# Altium project LXe_digitizer.PrjPcb (part 2 of 3)

## Sheet Processing Unit.SchDoc
size A1; DocumentNumber: 3; SheetNumber: 3; SheetTotal: 7
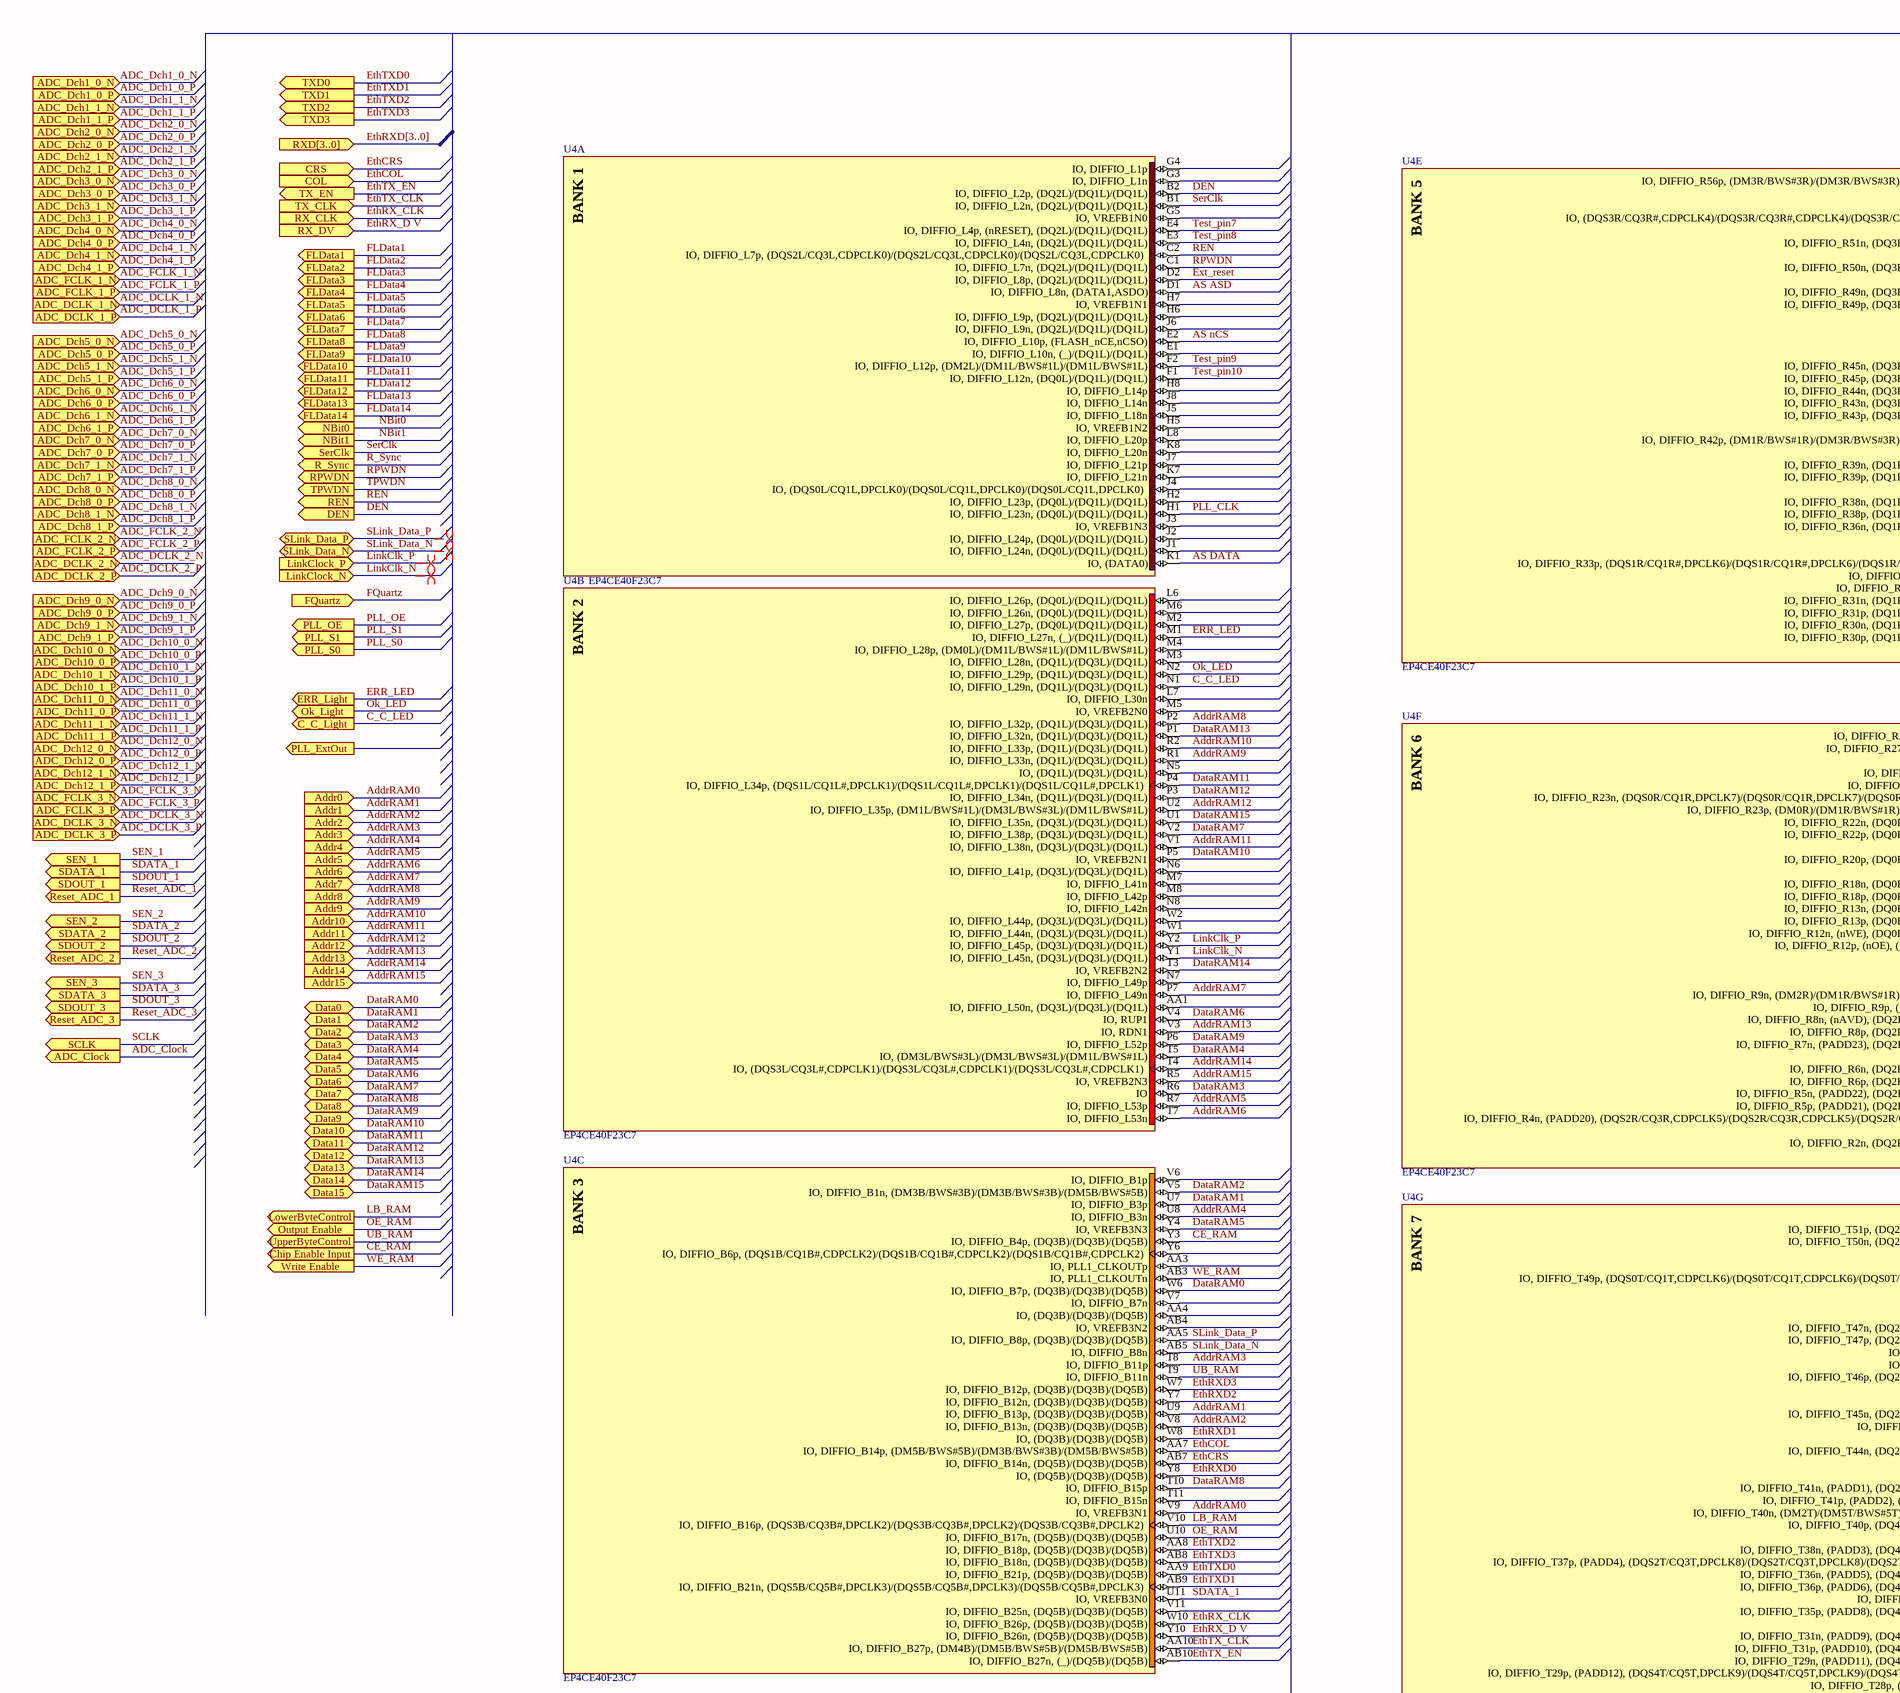
[diagram p4: Processing Unit.SchDoc, top left]
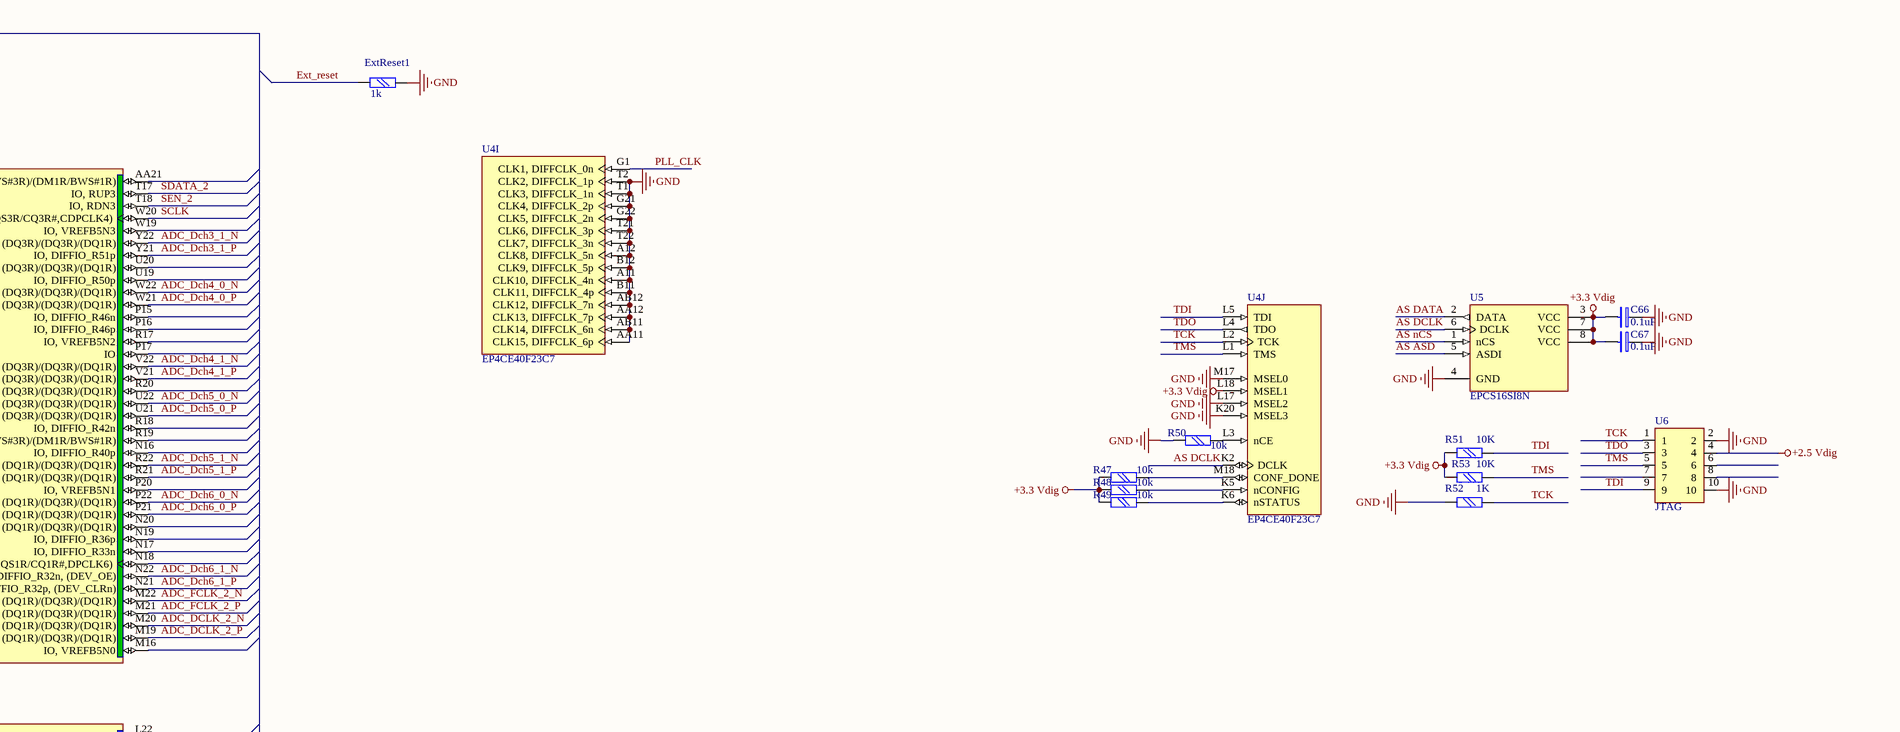
[diagram p5: Processing Unit.SchDoc, top right]
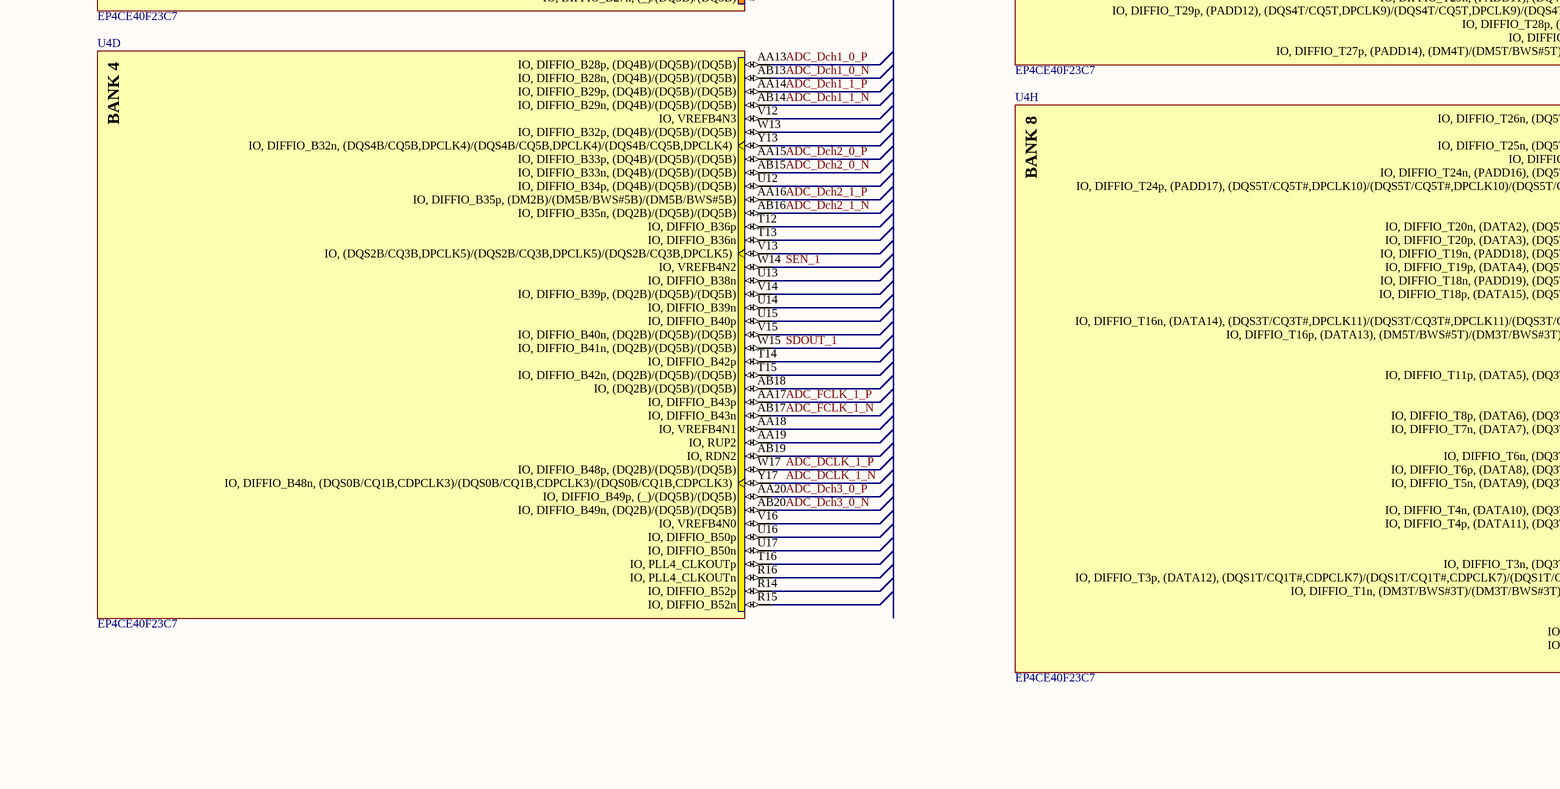
[diagram p6: Processing Unit.SchDoc, bottom left]
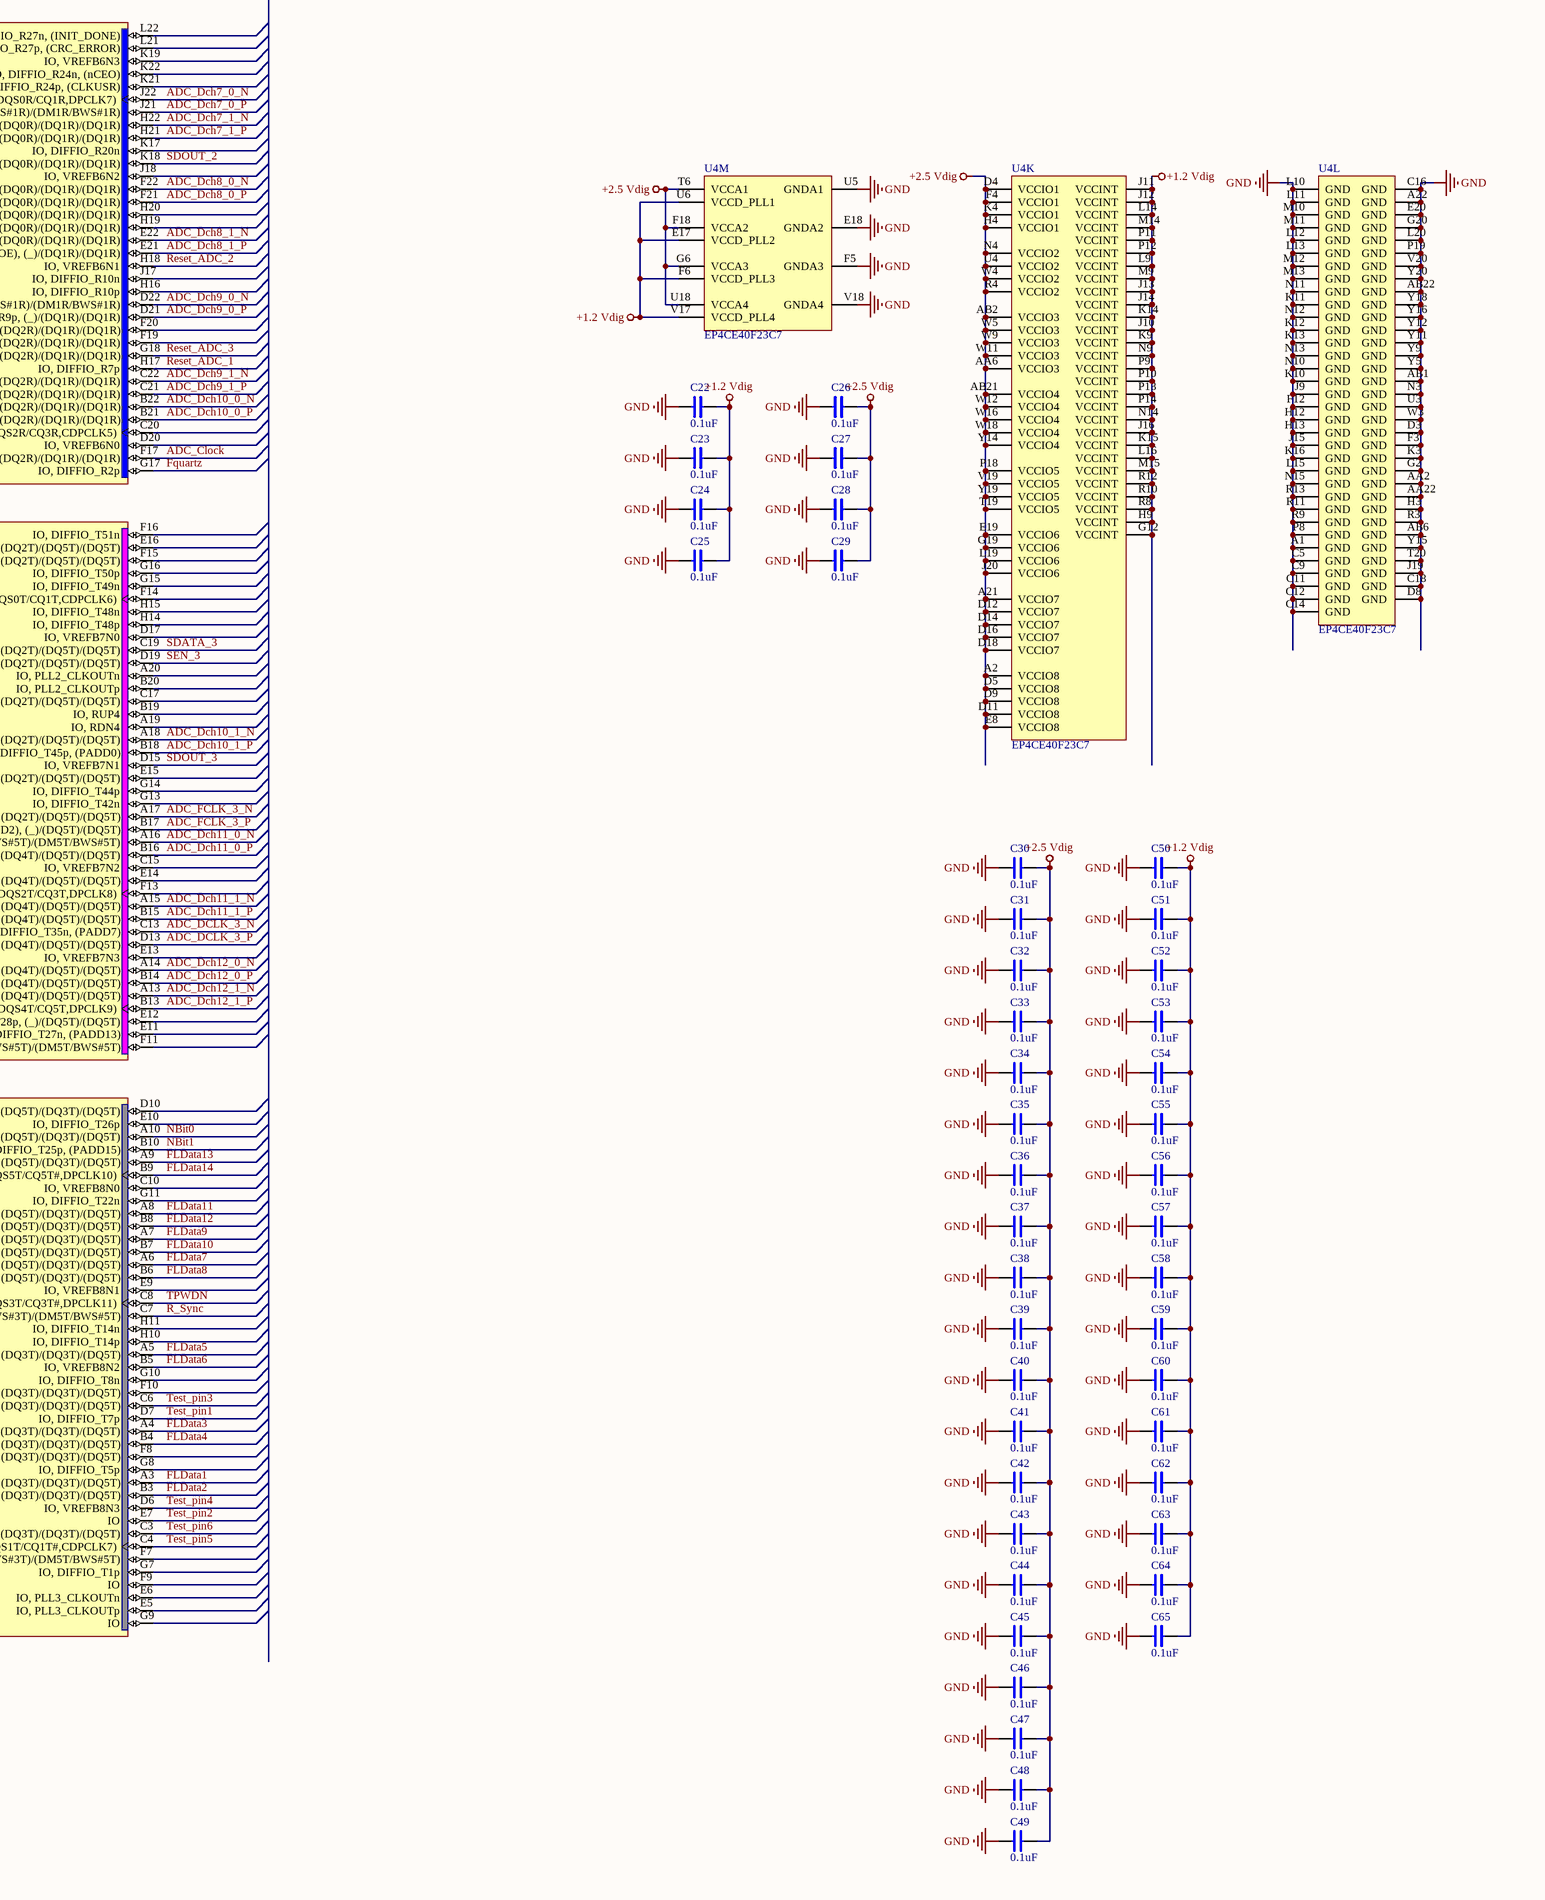
[diagram p7: Processing Unit.SchDoc, bottom right]

### Parts
C22  0.1uF  [0402]
C23  0.1uF  [0402]
C24  0.1uF  [0402]
C25  0.1uF  [0402]
C26  0.1uF  [0402]
C27  0.1uF  [0402]
C28  0.1uF  [0402]
C29  0.1uF  [0402]
C30  0.1uF  [0402]
C31  0.1uF  [0402]
C32  0.1uF  [0402]
C33  0.1uF  [0402]
C34  0.1uF  [0402]
C35  0.1uF  [0402]
C36  0.1uF  [0402]
C37  0.1uF  [0402]
C38  0.1uF  [0402]
C39  0.1uF  [0402]
C40  0.1uF  [0402]
C41  0.1uF  [0402]
C42  0.1uF  [0402]
C43  0.1uF  [0402]
C44  0.1uF  [0402]
C45  0.1uF  [0402]
C46  0.1uF  [0402]
C47  0.1uF  [0402]
C48  0.1uF  [0402]
C49  0.1uF  [0402]
C50  0.1uF  [0402]
C51  0.1uF  [0402]
C52  0.1uF  [0402]
C53  0.1uF  [0402]
C54  0.1uF  [0402]
C55  0.1uF  [0402]
C56  0.1uF  [0402]
C57  0.1uF  [0402]
C58  0.1uF  [0402]
C59  0.1uF  [0402]
C60  0.1uF  [0402]
C61  0.1uF  [0402]
C62  0.1uF  [0402]
C63  0.1uF  [0402]
C64  0.1uF  [0402]
C65  0.1uF  [0402]
C66  0.1uF  [chip0603]
C67  0.1uF  [chip0603]
ExtReset1  1k  [chip0603]
R47  10k  [chip0603]
R48  10k  [chip0603]
R49  10k  [chip0603]
R50  10k  [chip0603]
R51  10K  [chip0603]
R52  1K  [chip0603]
R53  10K  [chip0603]
U4  EP4CE40F23C7  [FBGA484]  (parts A,B,C,D,E,F,G,H,I,J,K,L,M of 13)
U5  EPCS16SI8N  [8SO200]
U6  JTAG  [IDC10]

### Ports
ADC_Clock (out), ADC_Dch1_0_N (in), ADC_Dch1_0_P (in), ADC_Dch1_1_N (in), ADC_Dch1_1_P (in), ADC_Dch2_0_N (in), ADC_Dch2_0_P (in), ADC_Dch2_1_N (in), ADC_Dch2_1_P (in), ADC_Dch3_0_N (in), ADC_Dch3_0_P (in), ADC_Dch3_1_N (in), ADC_Dch3_1_P (in), ADC_Dch4_0_N (in), ADC_Dch4_0_P (in), ADC_Dch4_1_N (in), ADC_Dch4_1_P (in), ADC_Dch5_0_N (in), ADC_Dch5_0_P (in), ADC_Dch5_1_N (in), ADC_Dch5_1_P (in), ADC_Dch6_0_N (in), ADC_Dch6_0_P (in), ADC_Dch6_1_N (in), ADC_Dch6_1_P (in), ADC_Dch7_0_N (in), ADC_Dch7_0_P (in), ADC_Dch7_1_N (in), ADC_Dch7_1_P (in), ADC_Dch8_0_N (in), ADC_Dch8_0_P (in), ADC_Dch8_1_N (in), ADC_Dch8_1_P (in), ADC_Dch9_0_N (in), ADC_Dch9_0_P (in), ADC_Dch9_1_N (in), ADC_Dch9_1_P (in), ADC_Dch10_0_N (in), ADC_Dch10_0_P (in), ADC_Dch10_1_N (in), ADC_Dch10_1_P (in), ADC_Dch11_0_N (in), ADC_Dch11_0_P (in), ADC_Dch11_1_N (in), ADC_Dch11_1_P (in), ADC_Dch12_0_N (in), ADC_Dch12_0_P (in), ADC_Dch12_1_N (in), ADC_Dch12_1_P (in), ADC_DCLK_1_N (in), ADC_DCLK_1_P (in), ADC_DCLK_2_N (in), ADC_DCLK_2_P (in), ADC_DCLK_3_N (in), ADC_DCLK_3_P (in), ADC_FCLK_1_N (in), ADC_FCLK_1_P (in), ADC_FCLK_2_N (in), ADC_FCLK_2_P (in), ADC_FCLK_3_N (in), ADC_FCLK_3_P (in), Addr0 (in), Addr1 (in), Addr2 (in), Addr3 (in), Addr4 (in), Addr5 (in), Addr6 (in), Addr7 (in), Addr8 (in), Addr9 (in), Addr10 (in), Addr11 (in), Addr12 (in), Addr13 (in), Addr14 (in), Addr15 (in), C_C_Light (out), Chip Enable Input (out), COL (in), CRS (in), Data0 (bidir), Data1 (bidir), Data2 (bidir), Data3 (bidir), Data4 (bidir), Data5 (bidir), Data6 (bidir), Data7 (bidir), Data8 (bidir), Data9 (bidir), Data10 (bidir), Data11 (bidir), Data12 (bidir), Data13 (bidir), Data14 (bidir), Data15 (bidir), DEN (out), ERR_Light (out), FLData1 (out), FLData2 (out), FLData3 (out), FLData4 (out), FLData5 (out), FLData6 (out), FLData7 (out), FLData8 (out), FLData9 (out), FLData10 (out), FLData11 (out), FLData12 (out), FLData13 (out), FLData14 (out), FQuartz (in), LinkClock_N (in), LinkClock_P (in), LowerByteControl (out), NBit0 (out), NBit1 (out), Ok_Light (out), Output Enable (out), PLL_ExtOut (out), PLL_OE (out), PLL_S0 (out), PLL_S1 (out), R_Sync (out), REN (out), Reset_ADC_1 (out), Reset_ADC_2 (out), Reset_ADC_3 (out), RPWDN (out), RX_CLK (in), RX_DV (in), RXD[3..0] (in), SCLK (out), SDATA_1 (out), SDATA_2 (out), SDATA_3 (out), SDOUT_1 (out), SDOUT_2 (out), SDOUT_3 (out), SEN_1 (out), SEN_2 (out), SEN_3 (out), SerClk (out), SLink_Data_N (bidir), SLink_Data_P (bidir), TPWDN (out), TX_CLK (in), TX_EN (out), TXD0 (out), TXD1 (out), TXD2 (out), TXD3 (out), UpperByteControl (out), Write Enable (out)

### Nets
+1.2 Vdig: C22.2 C23.2 C24.2 C25.2 C50.2 C51.2 C52.2 C53.2 C54.2 C55.2 C56.2 C57.2 C58.2 C59.2 C60.2 C61.2 C62.2 C63.2 C64.2 C65.2 U4.E17(VCCD_PLL2) U4.F6(VCCD_PLL3) U4.G12(VCCINT) U4.H9(VCCINT) U4.J10(VCCINT) U4.J11(VCCINT) U4.J12(VCCINT) U4.J13(VCCINT) U4.J14(VCCINT) U4.J16(VCCINT) U4.K9(VCCINT) U4.K14(VCCINT) U4.K15(VCCINT) U4.L9(VCCINT) U4.L14(VCCINT) U4.L16(VCCINT) U4.M9(VCCINT) U4.M14(VCCINT) U4.M15(VCCINT) U4.N9(VCCINT) U4.N14(VCCINT) U4.P9(VCCINT) U4.P10(VCCINT) U4.P11(VCCINT) U4.P12(VCCINT) U4.P13(VCCINT) U4.P14(VCCINT) U4.R8(VCCINT) U4.R10(VCCINT) U4.R12(VCCINT) U4.U6(VCCD_PLL1) U4.V17(VCCD_PLL4)
+2.5 Vdig: C26.2 C27.2 C28.2 C29.2 C30.2 C31.2 C32.2 C33.2 C34.2 C35.2 C36.2 C37.2 C38.2 C39.2 C40.2 C41.2 C42.2 C43.2 C44.2 C45.2 C46.2 C47.2 C48.2 C49.2 U4.A2(VCCIO8) U4.A21(VCCIO7) U4.AA6(VCCIO3) U4.AB2(VCCIO3) U4.AB21(VCCIO4) U4.D4(VCCIO1) U4.D5(VCCIO8) U4.D9(VCCIO8) U4.D11(VCCIO8) U4.D12(VCCIO7) U4.D14(VCCIO7) U4.D16(VCCIO7) U4.D18(VCCIO7) U4.E8(VCCIO8) U4.E19(VCCIO6) U4.F4(VCCIO1) U4.F18(VCCA2) U4.G6(VCCA3) U4.G19(VCCIO6) U4.H4(VCCIO1) U4.J20(VCCIO6) U4.K4(VCCIO1) U4.L19(VCCIO6) U4.N4(VCCIO2) U4.P18(VCCIO5) U4.R4(VCCIO2) U4.T6(VCCA1) U4.T19(VCCIO5) U4.U4(VCCIO2) U4.U18(VCCA4) U4.V19(VCCIO5) U4.W4(VCCIO2) U4.W5(VCCIO3) U4.W9(VCCIO3) U4.W11(VCCIO3) U4.W12(VCCIO4) U4.W16(VCCIO4) U4.W18(VCCIO4) U4.Y14(VCCIO4) U4.Y19(VCCIO5) U6.4
+3.3 Vdig: C66.2 C67.2 R47.1 R48.1 R49.1 R51.1 R53.1 U4.L18(MSEL1) U5.3(VCC) U5.7(VCC) U5.8(VCC)
GND: C22.1 C23.1 C24.1 C25.1 C26.1 C27.1 C28.1 C29.1 C30.1 C31.1 C32.1 C33.1 C34.1 C35.1 C36.1 C37.1 C38.1 C39.1 C40.1 C41.1 C42.1 C43.1 C44.1 C45.1 C46.1 C47.1 C48.1 C49.1 C50.1 C51.1 C52.1 C53.1 C54.1 C55.1 C56.1 C57.1 C58.1 C59.1 C60.1 C61.1 C62.1 C63.1 C64.1 C65.1 C66.1 C67.1 ExtReset1.2 R50.1 R52.1 U4.A1(GND) U4.A11(CLK10,_DIFFCLK_4n) U4.A12(CLK8,_DIFFCLK_5n) U4.A22(GND) U4.AA2(GND) U4.AA11(CLK15,_DIFFCLK_6p) U4.AA12(CLK13,_DIFFCLK_7p) U4.AA22(GND) U4.AB1(GND) U4.AB6(GND) U4.AB11(CLK14,_DIFFCLK_6n) U4.AB12(CLK12,_DIFFCLK_7n) U4.AB22(GND) U4.B11(CLK11,_DIFFCLK_4p) U4.B12(CLK9,_DIFFCLK_5p) U4.C5(GND) U4.C9(GND) U4.C11(GND) U4.C12(GND) U4.C14(GND) U4.C16(GND) U4.C18(GND) U4.D3(GND) U4.D8(GND) U4.E18(GNDA2) U4.E20(GND) U4.F3(GND) U4.F5(GNDA3) U4.F12(GND) U4.G2(GND) U4.G20(GND) U4.G21(CLK4,_DIFFCLK_2p) U4.G22(CLK5,_DIFFCLK_2n) U4.H3(GND) U4.H12(GND) U4.H13(GND) U4.J9(GND) U4.J15(GND) U4.J19(GND) U4.K3(GND) U4.K10(GND) U4.K11(GND) U4.K12(GND) U4.K13(GND) U4.K16(GND) U4.K20(MSEL3) U4.L10(GND) U4.L11(GND) U4.L12(GND) U4.L13(GND) U4.L15(GND) U4.L17(MSEL2) U4.L20(GND) U4.M10(GND) U4.M11(GND) U4.M12(GND) U4.M13(GND) U4.M17(MSEL0) U4.N3(GND) U4.N10(GND) U4.N11(GND) U4.N12(GND) U4.N13(GND) U4.N15(GND) U4.P8(GND) U4.P19(GND) U4.R3(GND) U4.R9(GND) U4.R11(GND) U4.R13(GND) U4.T1(CLK3,_DIFFCLK_1n) U4.T2(CLK2,_DIFFCLK_1p) U4.T20(GND) U4.T21(CLK6,_DIFFCLK_3p) U4.T22(CLK7,_DIFFCLK_3n) U4.U3(GND) U4.U5(GNDA1) U4.V18(GNDA4) U4.V20(GND) U4.W3(GND) U4.Y5(GND) U4.Y9(GND) U4.Y11(GND) U4.Y12(GND) U4.Y15(GND) U4.Y16(GND) U4.Y18(GND) U4.Y20(GND) U5.4(GND) U6.2 U6.10
LinkClk_N: U4.Y1(IO,_DIFFIO_L45n,_(DQ3L)/(DQ3L)/(DQ1L)) ; port LinkClock_N
LinkClk_P: U4.Y2(IO,_DIFFIO_L45p,_(DQ3L)/(DQ3L)/(DQ1L)) ; port LinkClock_P
ADC_Clock: U4.F17(IO,_DIFFIO_R2n,_(DQ2R)/(DQ1R)/(DQ1R)) ; port ADC_Clock
ADC_Dch1_0_N: U4.AB13(IO,_DIFFIO_B28n,_(DQ4B)/(DQ5B)/(DQ5B)) ; port ADC_Dch1_0_N
ADC_Dch1_0_P: U4.AA13(IO,_DIFFIO_B28p,_(DQ4B)/(DQ5B)/(DQ5B)) ; port ADC_Dch1_0_P
ADC_Dch1_1_N: U4.AB14(IO,_DIFFIO_B29n,_(DQ4B)/(DQ5B)/(DQ5B)) ; port ADC_Dch1_1_N
ADC_Dch1_1_P: U4.AA14(IO,_DIFFIO_B29p,_(DQ4B)/(DQ5B)/(DQ5B)) ; port ADC_Dch1_1_P
ADC_Dch2_0_N: U4.AB15(IO,_DIFFIO_B33n,_(DQ4B)/(DQ5B)/(DQ5B)) ; port ADC_Dch2_0_N
ADC_Dch2_0_P: U4.AA15(IO,_DIFFIO_B33p,_(DQ4B)/(DQ5B)/(DQ5B)) ; port ADC_Dch2_0_P
ADC_Dch2_1_N: U4.AB16(IO,_DIFFIO_B35n,_(DQ2B)/(DQ5B)/(DQ5B)) ; port ADC_Dch2_1_N
ADC_Dch2_1_P: U4.AA16(IO,_DIFFIO_B35p,_(DM2B)/(DM5B/BWS#5B)/(DM5B/BWS#5B)) ; port ADC_Dch2_1_P
ADC_Dch3_0_N: U4.AB20(IO,_DIFFIO_B49n,_(DQ2B)/(DQ5B)/(DQ5B)) ; port ADC_Dch3_0_N
ADC_Dch3_0_P: U4.AA20(IO,_DIFFIO_B49p,_(_)/(DQ5B)/(DQ5B)) ; port ADC_Dch3_0_P
ADC_Dch3_1_N: U4.Y22(IO,_DIFFIO_R51n,_(DQ3R)/(DQ3R)/(DQ1R)) ; port ADC_Dch3_1_N
ADC_Dch3_1_P: U4.Y21(IO,_DIFFIO_R51p) ; port ADC_Dch3_1_P
ADC_Dch4_0_N: U4.W22(IO,_DIFFIO_R49n,_(DQ3R)/(DQ3R)/(DQ1R)) ; port ADC_Dch4_0_N
ADC_Dch4_0_P: U4.W21(IO,_DIFFIO_R49p,_(DQ3R)/(DQ3R)/(DQ1R)) ; port ADC_Dch4_0_P
ADC_Dch4_1_N: U4.V22(IO,_DIFFIO_R45n,_(DQ3R)/(DQ3R)/(DQ1R)) ; port ADC_Dch4_1_N
ADC_Dch4_1_P: U4.V21(IO,_DIFFIO_R45p,_(DQ3R)/(DQ3R)/(DQ1R)) ; port ADC_Dch4_1_P
ADC_Dch5_0_N: U4.U22(IO,_DIFFIO_R43n,_(DQ3R)/(DQ3R)/(DQ1R)) ; port ADC_Dch5_0_N
ADC_Dch5_0_P: U4.U21(IO,_DIFFIO_R43p,_(DQ3R)/(DQ3R)/(DQ1R)) ; port ADC_Dch5_0_P
ADC_Dch5_1_N: U4.R22(IO,_DIFFIO_R39n,_(DQ1R)/(DQ3R)/(DQ1R)) ; port ADC_Dch5_1_N
ADC_Dch5_1_P: U4.R21(IO,_DIFFIO_R39p,_(DQ1R)/(DQ3R)/(DQ1R)) ; port ADC_Dch5_1_P
ADC_Dch6_0_N: U4.P22(IO,_DIFFIO_R38n,_(DQ1R)/(DQ3R)/(DQ1R)) ; port ADC_Dch6_0_N
ADC_Dch6_0_P: U4.P21(IO,_DIFFIO_R38p,_(DQ1R)/(DQ3R)/(DQ1R)) ; port ADC_Dch6_0_P
ADC_Dch6_1_N: U4.N22(IO,_DIFFIO_R32n,_(DEV_OE)) ; port ADC_Dch6_1_N
ADC_Dch6_1_P: U4.N21(IO,_DIFFIO_R32p,_(DEV_CLRn)) ; port ADC_Dch6_1_P
ADC_Dch7_0_N: U4.J22(IO,_DIFFIO_R23n,_(DQS0R/CQ1R,DPCLK7)/(DQS0R/CQ1R,DPCLK7)/(DQS0R/CQ1R,DPCLK7)) ; port ADC_Dch7_0_N
ADC_Dch7_0_P: U4.J21(IO,_DIFFIO_R23p,_(DM0R)/(DM1R/BWS#1R)/(DM1R/BWS#1R)) ; port ADC_Dch7_0_P
ADC_Dch7_1_N: U4.H22(IO,_DIFFIO_R22n,_(DQ0R)/(DQ1R)/(DQ1R)) ; port ADC_Dch7_1_N
ADC_Dch7_1_P: U4.H21(IO,_DIFFIO_R22p,_(DQ0R)/(DQ1R)/(DQ1R)) ; port ADC_Dch7_1_P
ADC_Dch8_0_N: U4.F22(IO,_DIFFIO_R18n,_(DQ0R)/(DQ1R)/(DQ1R)) ; port ADC_Dch8_0_N
ADC_Dch8_0_P: U4.F21(IO,_DIFFIO_R18p,_(DQ0R)/(DQ1R)/(DQ1R)) ; port ADC_Dch8_0_P
ADC_Dch8_1_N: U4.E22(IO,_DIFFIO_R12n,_(nWE),_(DQ0R)/(DQ1R)/(DQ1R)) ; port ADC_Dch8_1_N
ADC_Dch8_1_P: U4.E21(IO,_DIFFIO_R12p,_(nOE),_(_)/(DQ1R)/(DQ1R)) ; port ADC_Dch8_1_P
ADC_Dch9_0_N: U4.D22(IO,_DIFFIO_R9n,_(DM2R)/(DM1R/BWS#1R)/(DM1R/BWS#1R)) ; port ADC_Dch9_0_N
ADC_Dch9_0_P: U4.D21(IO,_DIFFIO_R9p,_(_)/(DQ1R)/(DQ1R)) ; port ADC_Dch9_0_P
ADC_Dch9_1_N: U4.C22(IO,_DIFFIO_R6n,_(DQ2R)/(DQ1R)/(DQ1R)) ; port ADC_Dch9_1_N
ADC_Dch9_1_P: U4.C21(IO,_DIFFIO_R6p,_(DQ2R)/(DQ1R)/(DQ1R)) ; port ADC_Dch9_1_P
ADC_Dch10_0_N: U4.B22(IO,_DIFFIO_R5n,_(PADD22),_(DQ2R)/(DQ1R)/(DQ1R)) ; port ADC_Dch10_0_N
ADC_Dch10_0_P: U4.B21(IO,_DIFFIO_R5p,_(PADD21),_(DQ2R)/(DQ1R)/(DQ1R)) ; port ADC_Dch10_0_P
ADC_Dch10_1_N: U4.A18(IO,_DIFFIO_T45n,_(DQ2T)/(DQ5T)/(DQ5T)) ; port ADC_Dch10_1_N
ADC_Dch10_1_P: U4.B18(IO,_DIFFIO_T45p,_(PADD0)) ; port ADC_Dch10_1_P
ADC_Dch11_0_N: U4.A16(IO,_DIFFIO_T40n,_(DM2T)/(DM5T/BWS#5T)/(DM5T/BWS#5T)) ; port ADC_Dch11_0_N
ADC_Dch11_0_P: U4.B16(IO,_DIFFIO_T40p,_(DQ4T)/(DQ5T)/(DQ5T)) ; port ADC_Dch11_0_P
ADC_Dch11_1_N: U4.A15(IO,_DIFFIO_T36n,_(PADD5),_(DQ4T)/(DQ5T)/(DQ5T)) ; port ADC_Dch11_1_N
ADC_Dch11_1_P: U4.B15(IO,_DIFFIO_T36p,_(PADD6),_(DQ4T)/(DQ5T)/(DQ5T)) ; port ADC_Dch11_1_P
ADC_Dch12_0_N: U4.A14(IO,_DIFFIO_T31n,_(PADD9),_(DQ4T)/(DQ5T)/(DQ5T)) ; port ADC_Dch12_0_N
ADC_Dch12_0_P: U4.B14(IO,_DIFFIO_T31p,_(PADD10),_(DQ4T)/(DQ5T)/(DQ5T)) ; port ADC_Dch12_0_P
ADC_Dch12_1_N: U4.A13(IO,_DIFFIO_T29n,_(PADD11),_(DQ4T)/(DQ5T)/(DQ5T)) ; port ADC_Dch12_1_N
ADC_Dch12_1_P: U4.B13(IO,_DIFFIO_T29p,_(PADD12),_(DQS4T/CQ5T,DPCLK9)/(DQS4T/CQ5T,DPCLK9)/(DQS4T/CQ5T,DPCLK9)) ; port ADC_Dch12_1_P
ADC_DCLK_1_N: U4.Y17(IO,_DIFFIO_B48n,_(DQS0B/CQ1B,CDPCLK3)/(DQS0B/CQ1B,CDPCLK3)/(DQS0B/CQ1B,CDPCLK3)) ; port ADC_DCLK_1_N
ADC_DCLK_1_P: U4.W17(IO,_DIFFIO_B48p,_(DQ2B)/(DQ5B)/(DQ5B)) ; port ADC_DCLK_1_P
ADC_DCLK_2_N: U4.M20(IO,_DIFFIO_R30n,_(DQ1R)/(DQ3R)/(DQ1R)) ; port ADC_DCLK_2_N
ADC_DCLK_2_P: U4.M19(IO,_DIFFIO_R30p,_(DQ1R)/(DQ3R)/(DQ1R)) ; port ADC_DCLK_2_P
ADC_DCLK_3_N: U4.C13(IO,_DIFFIO_T35n,_(PADD7)) ; port ADC_DCLK_3_N
ADC_DCLK_3_P: U4.D13(IO,_DIFFIO_T35p,_(PADD8),_(DQ4T)/(DQ5T)/(DQ5T)) ; port ADC_DCLK_3_P
ADC_FCLK_1_N: U4.AB17(IO,_DIFFIO_B43n) ; port ADC_FCLK_1_N
ADC_FCLK_1_P: U4.AA17(IO,_DIFFIO_B43p) ; port ADC_FCLK_1_P
ADC_FCLK_2_N: U4.M22(IO,_DIFFIO_R31n,_(DQ1R)/(DQ3R)/(DQ1R)) ; port ADC_FCLK_2_N
ADC_FCLK_2_P: U4.M21(IO,_DIFFIO_R31p,_(DQ1R)/(DQ3R)/(DQ1R)) ; port ADC_FCLK_2_P
ADC_FCLK_3_N: U4.A17(IO,_DIFFIO_T41n,_(PADD1),_(DQ2T)/(DQ5T)/(DQ5T)) ; port ADC_FCLK_3_N
ADC_FCLK_3_P: U4.B17(IO,_DIFFIO_T41p,_(PADD2),_(_)/(DQ5T)/(DQ5T)) ; port ADC_FCLK_3_P
AddrRAM0: U4.V9(IO,_VREFB3N1) ; port Addr0
AddrRAM1: U4.U9(IO,_DIFFIO_B13p,_(DQ3B)/(DQ3B)/(DQ5B)) ; port Addr1
AddrRAM2: U4.V8(IO,_DIFFIO_B13n,_(DQ3B)/(DQ3B)/(DQ5B)) ; port Addr2
AddrRAM3: U4.T8(IO,_DIFFIO_B11p) ; port Addr3
AddrRAM4: U4.U8(IO,_DIFFIO_B3n) ; port Addr4
AddrRAM5: U4.R7(IO,_DIFFIO_L53p) ; port Addr5
AddrRAM6: U4.T7(IO,_DIFFIO_L53n) ; port Addr6
AddrRAM7: U4.P7(IO,_DIFFIO_L49n) ; port Addr7
AddrRAM8: U4.P2(IO,_DIFFIO_L32p,_(DQ1L)/(DQ3L)/(DQ1L)) ; port Addr8
AddrRAM9: U4.R1(IO,_DIFFIO_L33n,_(DQ1L)/(DQ3L)/(DQ1L)) ; port Addr9
AddrRAM10: U4.R2(IO,_DIFFIO_L33p,_(DQ1L)/(DQ3L)/(DQ1L)) ; port Addr10
AddrRAM11: U4.V1(IO,_DIFFIO_L38n,_(DQ3L)/(DQ3L)/(DQ1L)) ; port Addr11
AddrRAM12: U4.U2(IO,_DIFFIO_L35p,_(DM1L/BWS#1L)/(DM3L/BWS#3L)/(DM1L/BWS#1L)) ; port Addr12
AddrRAM13: U4.V3(IO,_RDN1) ; port Addr13
AddrRAM14: U4.T4(IO,_(DQS3L/CQ3L#,CDPCLK1)/(DQS3L/CQ3L#,CDPCLK1)/(DQS3L/CQ3L#,CDPCLK1)) ; port Addr14
AddrRAM15: U4.R5(IO,_VREFB2N3) ; port Addr15
AS ASD: U4.D1(IO,_DIFFIO_L8n,_(DATA1,ASDO)) U5.5(ASDI)
AS DATA: U4.K1(IO,_(DATA0)) U5.2(DATA)
AS DCLK: U4.K2(DCLK) U5.6(DCLK)
AS nCS: U4.E2(IO,_DIFFIO_L10p,_(FLASH_nCE,nCSO)) U5.1(nCS)
C_C_LED: U4.N1(IO,_DIFFIO_L29n,_(DQ1L)/(DQ3L)/(DQ1L)) ; port C_C_Light
CE_RAM: U4.Y3(IO,_DIFFIO_B4p,_(DQ3B)/(DQ3B)/(DQ5B)) ; port Chip Enable Input
DataRAM0: U4.W6(IO,_DIFFIO_B7p,_(DQ3B)/(DQ3B)/(DQ5B)) ; port Data0
DataRAM1: U4.U7(IO,_DIFFIO_B3p) ; port Data1
DataRAM2: U4.V5(IO,_DIFFIO_B1n,_(DM3B/BWS#3B)/(DM3B/BWS#3B)/(DM5B/BWS#5B)) ; port Data2
DataRAM3: U4.R6(IO) ; port Data3
DataRAM4: U4.T5(IO,_(DM3L/BWS#3L)/(DM3L/BWS#3L)/(DM1L/BWS#1L)) ; port Data4
DataRAM5: U4.Y4(IO,_VREFB3N3) ; port Data5
DataRAM6: U4.V4(IO,_RUP1) ; port Data6
DataRAM7: U4.V2(IO,_DIFFIO_L38p,_(DQ3L)/(DQ3L)/(DQ1L)) ; port Data7
DataRAM8: U4.T10(IO,_DIFFIO_B15p) ; port Data8
DataRAM9: U4.P6(IO,_DIFFIO_L52p) ; port Data9
DataRAM10: U4.P5(IO,_VREFB2N1) ; port Data10
DataRAM11: U4.P4(IO,_DIFFIO_L34p,_(DQS1L/CQ1L#,DPCLK1)/(DQS1L/CQ1L#,DPCLK1)/(DQS1L/CQ1L#,DPCLK1)) ; port Data11
DataRAM12: U4.P3(IO,_DIFFIO_L34n,_(DQ1L)/(DQ3L)/(DQ1L)) ; port Data12
DataRAM13: U4.P1(IO,_DIFFIO_L32n,_(DQ1L)/(DQ3L)/(DQ1L)) ; port Data13
DataRAM14: U4.T3(IO,_VREFB2N2) ; port Data14
DataRAM15: U4.U1(IO,_DIFFIO_L35n,_(DQ3L)/(DQ3L)/(DQ1L)) ; port Data15
DEN: U4.B2(IO,_DIFFIO_L2p,_(DQ2L)/(DQ1L)/(DQ1L)) ; port DEN
ERR_LED: U4.M1(IO,_DIFFIO_L27n,_(_)/(DQ1L)/(DQ1L)) ; port ERR_Light
EthCOL: U4.AA7(IO,_DIFFIO_B14p,_(DM5B/BWS#5B)/(DM3B/BWS#3B)/(DM5B/BWS#5B)) ; port COL  [project net COL]
EthCRS: U4.AB7(IO,_DIFFIO_B14n,_(DQ5B)/(DQ3B)/(DQ5B)) ; port CRS  [project net CRS]
EthRX_CLK: U4.W10(IO,_DIFFIO_B26p,_(DQ5B)/(DQ3B)/(DQ5B)) ; port RX_CLK
EthRX_D V: U4.Y10(IO,_DIFFIO_B26n,_(DQ5B)/(DQ3B)/(DQ5B)) ; port RX_DV
EthRXD0: U4.Y8(IO,_(DQ5B)/(DQ3B)/(DQ5B))
EthRXD1: U4.W8(IO,_(DQ3B)/(DQ3B)/(DQ5B))
EthRXD2: U4.Y7(IO,_DIFFIO_B12n,_(DQ3B)/(DQ3B)/(DQ5B))
EthRXD3: U4.W7(IO,_DIFFIO_B12p,_(DQ3B)/(DQ3B)/(DQ5B))
EthTX_CLK: U4.AA10(IO,_DIFFIO_B27p,_(DM4B)/(DM5B/BWS#5B)/(DM5B/BWS#5B)) ; port TX_CLK
EthTX_EN: U4.AB10(IO,_DIFFIO_B27n,_(_)/(DQ5B)/(DQ5B)) ; port TX_EN
EthTXD0: U4.AA9(IO,_DIFFIO_B21p,_(DQ5B)/(DQ3B)/(DQ5B)) ; port TXD0
EthTXD1: U4.AB9(IO,_DIFFIO_B21n,_(DQS5B/CQ5B#,DPCLK3)/(DQS5B/CQ5B#,DPCLK3)/(DQS5B/CQ5B#,DPCLK3)) ; port TXD1
EthTXD2: U4.AA8(IO,_DIFFIO_B18p,_(DQ5B)/(DQ3B)/(DQ5B)) ; port TXD2
EthTXD3: U4.AB8(IO,_DIFFIO_B18n,_(DQ5B)/(DQ3B)/(DQ5B)) ; port TXD3
Ext_reset: ExtReset1.1 U4.D2(IO,_DIFFIO_L8p,_(DQ2L)/(DQ1L)/(DQ1L))
FLData1: U4.A3(IO,_DIFFIO_T4n,_(DATA10),_(DQ3T)/(DQ3T)/(DQ5T)) ; port FLData1
FLData2: U4.B3(IO,_DIFFIO_T4p,_(DATA11),_(DQ3T)/(DQ3T)/(DQ5T)) ; port FLData2
FLData3: U4.A4(IO,_DIFFIO_T6n,_(DQ3T)/(DQ3T)/(DQ5T)) ; port FLData3
FLData4: U4.B4(IO,_DIFFIO_T6p,_(DATA8),_(DQ3T)/(DQ3T)/(DQ5T)) ; port FLData4
FLData5: U4.A5(IO,_DIFFIO_T11p,_(DATA5),_(DQ3T)/(DQ3T)/(DQ5T)) ; port FLData5
FLData6: U4.B5(IO,_VREFB8N2) ; port FLData6
FLData7: U4.A6(IO,_DIFFIO_T18n,_(PADD19),_(DQ5T)/(DQ3T)/(DQ5T)) ; port FLData7
FLData8: U4.B6(IO,_DIFFIO_T18p,_(DATA15),_(DQ5T)/(DQ3T)/(DQ5T)) ; port FLData8
FLData9: U4.A7(IO,_DIFFIO_T19n,_(PADD18),_(DQ5T)/(DQ3T)/(DQ5T)) ; port FLData9
FLData10: U4.B7(IO,_DIFFIO_T19p,_(DATA4),_(DQ5T)/(DQ3T)/(DQ5T)) ; port FLData10
FLData11: U4.A8(IO,_DIFFIO_T20n,_(DATA2),_(DQ5T)/(DQ3T)/(DQ5T)) ; port FLData11
FLData12: U4.B8(IO,_DIFFIO_T20p,_(DATA3),_(DQ5T)/(DQ3T)/(DQ5T)) ; port FLData12
FLData13: U4.A9(IO,_DIFFIO_T24n,_(PADD16),_(DQ5T)/(DQ3T)/(DQ5T)) ; port FLData13
FLData14: U4.B9(IO,_DIFFIO_T24p,_(PADD17),_(DQS5T/CQ5T#,DPCLK10)/(DQS5T/CQ5T#,DPCLK10)/(DQS5T/CQ5T#,DPCLK10)) ; port FLData14
FQuartz: U4.G17(IO,_DIFFIO_R2p) ; port FQuartz
LB_RAM: U4.V10(IO,_DIFFIO_B16p,_(DQS3B/CQ3B#,DPCLK2)/(DQS3B/CQ3B#,DPCLK2)/(DQS3B/CQ3B#,DPCLK2)) ; port LowerByteControl
NBit0: U4.A10(IO,_DIFFIO_T25n,_(DQ5T)/(DQ3T)/(DQ5T)) ; port NBit0
NBit1: U4.B10(IO,_DIFFIO_T25p,_(PADD15)) ; port NBit1
OE_RAM: U4.U10(IO,_DIFFIO_B17n,_(DQ5B)/(DQ3B)/(DQ5B)) ; port Output Enable
Ok_LED: U4.N2(IO,_DIFFIO_L29p,_(DQ1L)/(DQ3L)/(DQ1L)) ; port Ok_Light
PLL_CLK: U4.G1(CLK1,_DIFFCLK_0n) U4.H1(IO,_DIFFIO_L23n,_(DQ0L)/(DQ1L)/(DQ1L))
R_Sync: U4.C7(IO,_DIFFIO_T16p,_(DATA13),_(DM5T/BWS#5T)/(DM3T/BWS#3T)/(DM5T/BWS#5T)) ; port R_Sync
REN: U4.C2(IO,_DIFFIO_L7p,_(DQS2L/CQ3L,CDPCLK0)/(DQS2L/CQ3L,CDPCLK0)/(DQS2L/CQ3L,CDPCLK0)) ; port REN
Reset_ADC_1: U4.H17(IO,_DIFFIO_R7p) ; port Reset_ADC_1  [project net Reset_ADC]
Reset_ADC_2: U4.H18(IO,_VREFB6N1) ; port Reset_ADC_2  [project net Reset_ADC]
Reset_ADC_3: U4.G18(IO,_DIFFIO_R7n,_(PADD23),_(DQ2R)/(DQ1R)/(DQ1R)) ; port Reset_ADC_3  [project net Reset_ADC]
RPWDN: U4.C1(IO,_DIFFIO_L7n,_(DQ2L)/(DQ1L)/(DQ1L)) ; port RPWDN
SCLK: U4.W20(IO,_(DQS3R/CQ3R#,CDPCLK4)/(DQS3R/CQ3R#,CDPCLK4)/(DQS3R/CQ3R#,CDPCLK4)) ; port SCLK
SDATA_1: U4.U11(IO,_VREFB3N0) ; port SDATA_1  [project net SDATA]
SDATA_2: U4.T17(IO,_RUP3) ; port SDATA_2  [project net SDATA]
SDATA_3: U4.C19(IO,_DIFFIO_T47n,_(DQ2T)/(DQ5T)/(DQ5T)) ; port SDATA_3  [project net SDATA]
SDOUT_1: U4.W15(IO,_DIFFIO_B41n,_(DQ2B)/(DQ5B)/(DQ5B)) ; port SDOUT_1  [project net SDOUT]
SDOUT_2: U4.K18(IO,_DIFFIO_R20p,_(DQ0R)/(DQ1R)/(DQ1R)) ; port SDOUT_2  [project net SDOUT]
SDOUT_3: U4.D15(IO,_VREFB7N1) ; port SDOUT_3  [project net SDOUT]
SEN_1: U4.W14(IO,_VREFB4N2) ; port SEN_1  [project net SEN]
SEN_2: U4.T18(IO,_RDN3) ; port SEN_2  [project net SEN]
SEN_3: U4.D19(IO,_DIFFIO_T47p,_(DQ2T)/(DQ5T)/(DQ5T)) ; port SEN_3  [project net SEN]
SerClk: U4.B1(IO,_DIFFIO_L2n,_(DQ2L)/(DQ1L)/(DQ1L)) ; port SerClk
SLink_Data_N: U4.AB5(IO,_DIFFIO_B8n) ; port SLink_Data_N
SLink_Data_P: U4.AA5(IO,_DIFFIO_B8p,_(DQ3B)/(DQ3B)/(DQ5B)) ; port SLink_Data_P
TCK: R52.2 U4.L2(TCK) U6.1
TDI: R51.2 U4.L5(TDI) U6.9
TDO: U4.L4(TDO) U6.3
Test_pin1: U4.D7(IO,_DIFFIO_T7p)
Test_pin2: U4.E7(IO)
Test_pin3: U4.C6(IO,_DIFFIO_T7n,_(DATA7),_(DQ3T)/(DQ3T)/(DQ5T))
Test_pin4: U4.D6(IO,_VREFB8N3)
Test_pin5: U4.C4(IO,_DIFFIO_T3p,_(DATA12),_(DQS1T/CQ1T#,CDPCLK7)/(DQS1T/CQ1T#,CDPCLK7)/(DQS1T/CQ1T#,CDPCLK7))
Test_pin6: U4.C3(IO,_DIFFIO_T3n,_(DQ3T)/(DQ3T)/(DQ5T))
Test_pin7: U4.E4(IO,_DIFFIO_L4p,_(nRESET),_(DQ2L)/(DQ1L)/(DQ1L))
Test_pin8: U4.E3(IO,_DIFFIO_L4n,_(DQ2L)/(DQ1L)/(DQ1L))
Test_pin9: U4.F2(IO,_DIFFIO_L12p,_(DM2L)/(DM1L/BWS#1L)/(DM1L/BWS#1L))
Test_pin10: U4.F1(IO,_DIFFIO_L12n,_(DQ0L)/(DQ1L)/(DQ1L))
TMS: R53.2 U4.L1(TMS) U6.5
TPWDN: U4.C8(IO,_DIFFIO_T16n,_(DATA14),_(DQS3T/CQ3T#,DPCLK11)/(DQS3T/CQ3T#,DPCLK11)/(DQS3T/CQ3T#,DPCLK11)) ; port TPWDN
UB_RAM: U4.T9(IO,_DIFFIO_B11n) ; port UpperByteControl
WE_RAM: U4.AB3(IO,_PLL1_CLKOUTn) ; port Write Enable
NetR47_2: R47.2 U4.M18(CONF_DONE)
NetR48_2: R48.2 U4.K5(nCONFIG)
NetR49_2: R49.2 U4.K6(nSTATUS)
NetR50_2: R50.2 U4.L3(nCE)

Not connected (* = marked no-connect by the designer): U4 A19(IO,_RDN4) A20(IO,_PLL2_CLKOUTn) AA1(IO,_DIFFIO_L50n,_(DQ3L)/(DQ3L)/(DQ1L)) AA3(IO,_PLL1_CLKOUTp) AA4(IO,_(DQ3B)/(DQ3B)/(DQ5B)) AA18(IO,_VREFB4N1) AA19(IO,_RUP2) AA21(IO,_DIFFIO_R56p,_(DM3R/BWS#3R)/(DM3R/BWS#3R)/(DM1R/BWS#1R)) AB4(IO,_VREFB3N2) AB18(IO,_(DQ2B)/(DQ5B)/(DQ5B)) AB19(IO,_RDN2) B19(IO,_RUP4) B20(IO,_PLL2_CLKOUTp) C10(IO,_VREFB8N0) C15(IO,_VREFB7N2) C17(IO,_DIFFIO_T46p,_(DQ2T)/(DQ5T)/(DQ5T)) C20(IO,_DIFFIO_R4n,_(PADD20),_(DQS2R/CQ3R,CDPCLK5)/(DQS2R/CQ3R,CDPCLK5)/(DQS2R/CQ3R,CDPCLK5)) D10(IO,_DIFFIO_T26n,_(DQ5T)/(DQ3T)/(DQ5T)) D17(IO,_VREFB7N0) D20(IO,_VREFB6N0) E1(IO,_DIFFIO_L10n,_(_)/(DQ1L)/(DQ1L)) E5(IO,_PLL3_CLKOUTp) E6(IO,_PLL3_CLKOUTn) E9(IO,_VREFB8N1) E10(IO,_DIFFIO_T26p) E11(IO,_DIFFIO_T27n,_(PADD13)) E12(IO,_DIFFIO_T28p,_(_)/(DQ5T)/(DQ5T)) E13(IO,_VREFB7N3) E14(IO,_DIFFIO_T38n,_(PADD3),_(DQ4T)/(DQ5T)/(DQ5T)) E15(IO,_DIFFIO_T44n,_(DQ2T)/(DQ5T)/(DQ5T)) E16(IO,_DIFFIO_T51p,_(DQ2T)/(DQ5T)/(DQ5T)) F7(IO,_DIFFIO_T1n,_(DM3T/BWS#3T)/(DM3T/BWS#3T)/(DM5T/BWS#5T)) F8(IO,_DIFFIO_T5n,_(DATA9),_(DQ3T)/(DQ3T)/(DQ5T)) F9(IO) F10(IO,_DIFFIO_T8p,_(DATA6),_(DQ3T)/(DQ3T)/(DQ5T)) F11(IO,_DIFFIO_T27p,_(PADD14),_(DM4T)/(DM5T/BWS#5T)/(DM5T/BWS#5T)) F13(IO,_DIFFIO_T37p,_(PADD4),_(DQS2T/CQ3T,DPCLK8)/(DQS2T/CQ3T,DPCLK8)/(DQS2T/CQ3T,DPCLK8)) F14(IO,_DIFFIO_T49p,_(DQS0T/CQ1T,CDPCLK6)/(DQS0T/CQ1T,CDPCLK6)/(DQS0T/CQ1T,CDPCLK6)) F15(IO,_DIFFIO_T50n,_(DQ2T)/(DQ5T)/(DQ5T)) F16(IO,_DIFFIO_T51n) F19(IO,_DIFFIO_R8p,_(DQ2R)/(DQ1R)/(DQ1R)) F20(IO,_DIFFIO_R8n,_(nAVD),_(DQ2R)/(DQ1R)/(DQ1R)) G3(IO,_DIFFIO_L1n) G4(IO,_DIFFIO_L1p) G5(IO,_VREFB1N0) G7(IO,_DIFFIO_T1p) G8(IO,_DIFFIO_T5p) G9(IO) G10(IO,_DIFFIO_T8n) G11(IO,_DIFFIO_T22n) G13(IO,_DIFFIO_T42n) G14(IO,_DIFFIO_T44p) G15(IO,_DIFFIO_T49n) G16(IO,_DIFFIO_T50p) H2(IO,_DIFFIO_L23p,_(DQ0L)/(DQ1L)/(DQ1L)) H5(IO,_VREFB1N2) H6(IO,_DIFFIO_L9p,_(DQ2L)/(DQ1L)/(DQ1L)) H7(IO,_VREFB1N1) H8(IO,_DIFFIO_L14p) H10(IO,_DIFFIO_T14p) H11(IO,_DIFFIO_T14n) H14(IO,_DIFFIO_T48p) H15(IO,_DIFFIO_T48n) H16(IO,_DIFFIO_R10p) H19(IO,_DIFFIO_R13p,_(DQ0R)/(DQ1R)/(DQ1R)) H20(IO,_DIFFIO_R13n,_(DQ0R)/(DQ1R)/(DQ1R)) J1(IO,_DIFFIO_L24n,_(DQ0L)/(DQ1L)/(DQ1L)) J2(IO,_DIFFIO_L24p,_(DQ0L)/(DQ1L)/(DQ1L)) J3(IO,_VREFB1N3) J4(IO,_(DQS0L/CQ1L,DPCLK0)/(DQS0L/CQ1L,DPCLK0)/(DQS0L/CQ1L,DPCLK0)) J5(IO,_DIFFIO_L18n) J6(IO,_DIFFIO_L9n,_(DQ2L)/(DQ1L)/(DQ1L)) J7(IO,_DIFFIO_L21p) J8(IO,_DIFFIO_L14n) J17(IO,_DIFFIO_R10n) J18(IO,_VREFB6N2) K7(IO,_DIFFIO_L21n) K8(IO,_DIFFIO_L20n) K17(IO,_DIFFIO_R20n) K19(IO,_VREFB6N3) K21(IO,_DIFFIO_R24p,_(CLKUSR)) K22(IO,_DIFFIO_R24n,_(nCEO)) L6(IO,_DIFFIO_L26p,_(DQ0L)/(DQ1L)/(DQ1L)) L7(IO,_DIFFIO_L30n) L8(IO,_DIFFIO_L20p) L21(IO,_DIFFIO_R27p,_(CRC_ERROR)) L22(IO,_DIFFIO_R27n,_(INIT_DONE)) M2(IO,_DIFFIO_L27p,_(DQ0L)/(DQ1L)/(DQ1L)) M3(IO,_DIFFIO_L28n,_(DQ1L)/(DQ3L)/(DQ1L)) M4(IO,_DIFFIO_L28p,_(DM0L)/(DM1L/BWS#1L)/(DM1L/BWS#1L)) M5(IO,_VREFB2N0) M6(IO,_DIFFIO_L26n,_(DQ0L)/(DQ1L)/(DQ1L)) M7(IO,_DIFFIO_L41n) M8(IO,_DIFFIO_L42p) M16(IO,_VREFB5N0) N5(IO,_(DQ1L)/(DQ3L)/(DQ1L)) N6(IO,_DIFFIO_L41p,_(DQ3L)/(DQ3L)/(DQ1L)) N7(IO,_DIFFIO_L49p) N8(IO,_DIFFIO_L42n) N16(IO,_DIFFIO_R40p) N17(IO,_DIFFIO_R33n) N18(IO,_DIFFIO_R33p,_(DQS1R/CQ1R#,DPCLK6)/(DQS1R/CQ1R#,DPCLK6)/(DQS1R/CQ1R#,DPCLK6)) N19(IO,_DIFFIO_R36p) N20(IO,_DIFFIO_R36n,_(DQ1R)/(DQ3R)/(DQ1R)) P15(IO,_DIFFIO_R46n) P16(IO,_DIFFIO_R46p) P17(IO) P20(IO,_VREFB5N1) R14(IO,_DIFFIO_B52p) R15(IO,_DIFFIO_B52n) R16(IO,_PLL4_CLKOUTn) R17(IO,_VREFB5N2) R18(IO,_DIFFIO_R42n) R19(IO,_DIFFIO_R42p,_(DM1R/BWS#1R)/(DM3R/BWS#3R)/(DM1R/BWS#1R)) R20(IO,_DIFFIO_R44n,_(DQ3R)/(DQ3R)/(DQ1R)) T11(IO,_DIFFIO_B15n) T12(IO,_DIFFIO_B36p) T13(IO,_DIFFIO_B36n) T14(IO,_DIFFIO_B42p) T15(IO,_DIFFIO_B42n,_(DQ2B)/(DQ5B)/(DQ5B)) T16(IO,_PLL4_CLKOUTp) U12(IO,_DIFFIO_B34p,_(DQ4B)/(DQ5B)/(DQ5B)) U13(IO,_DIFFIO_B38n) U14(IO,_DIFFIO_B39n) U15(IO,_DIFFIO_B40p) U16(IO,_DIFFIO_B50p) U17(IO,_DIFFIO_B50n) U19(IO,_DIFFIO_R50p) U20(IO,_DIFFIO_R50n,_(DQ3R)/(DQ3R)/(DQ1R)) V6(IO,_DIFFIO_B1p) V7(IO,_DIFFIO_B7n) V11(IO,_DIFFIO_B25n,_(DQ5B)/(DQ3B)/(DQ5B)) V12(IO,_VREFB4N3) V13(IO,_(DQS2B/CQ3B,DPCLK5)/(DQS2B/CQ3B,DPCLK5)/(DQS2B/CQ3B,DPCLK5)) V14(IO,_DIFFIO_B39p,_(DQ2B)/(DQ5B)/(DQ5B)) V15(IO,_DIFFIO_B40n,_(DQ2B)/(DQ5B)/(DQ5B)) V16(IO,_VREFB4N0) W1(IO,_DIFFIO_L44n,_(DQ3L)/(DQ3L)/(DQ1L)) W2(IO,_DIFFIO_L44p,_(DQ3L)/(DQ3L)/(DQ1L)) W13(IO,_DIFFIO_B32p,_(DQ4B)/(DQ5B)/(DQ5B)) W19(IO,_VREFB5N3) Y6(IO,_DIFFIO_B6p,_(DQS1B/CQ1B#,CDPCLK2)/(DQS1B/CQ1B#,CDPCLK2)/(DQS1B/CQ1B#,CDPCLK2)) Y13(IO,_DIFFIO_B32n,_(DQS4B/CQ5B,DPCLK4)/(DQS4B/CQ5B,DPCLK4)/(DQS4B/CQ5B,DPCLK4)); U6 6 7 8

### Buses and harness runs
bus EthRXD[3..0] = port RXD[3..0]

### Layout directives
differential pair: LinkClk_N, LinkClk_P, SLink_Data_N, SLink_Data_P

### Notes on the sheet
- (in symbol EP4CE40F23C7, part A) BANK 1
- (in symbol EP4CE40F23C7, part B) BANK 2
- (in symbol EP4CE40F23C7, part C) BANK 3
- (in symbol EP4CE40F23C7, part D) BANK 4
- (in symbol EP4CE40F23C7, part E) BANK 5
- (in symbol EP4CE40F23C7, part F) BANK 6
- (in symbol EP4CE40F23C7, part G) BANK 7
- (in symbol EP4CE40F23C7, part H) BANK 8

### Library data of the parts
C22-C67 = C: Text Field1: 20; Text Field2: 10
ExtReset1 R47-R53 = R: Text Field1: 20; Text Field2: 20
U4 = EP4CE40F23C7: Cyclone IV Family FPGA, 2V Core, 328 I/O Pins, 4 PLLs, 484-Pin FBGA, Speed Grade 7, Commercial Grade; Published: 3-May-2010; DatasheetVersion: ver1.2, Mar-2010; PackageVersion: ver16.0, Dec-2009; PackageReference: FBGA484; Publisher: Altium Limited; PackageDescription: 484-Ball FineLine Ball Grid Array (FBGA484) - Flip Chip; Supplier 1: Digi-Key; Supplier Part Number 1: EP4CE40F23C7-ND; Code_JEDEC: MS-034-AAJ-1; Code_IPC: BGA100P22X22-484; ComponentLink1Description: Manufacturer Link; ComponentLink1URL: http://www.altera.com/; ComponentLink2Description: Handbook; ComponentLink2URL: http://www.altera.com/literature/hb/cyclone-iv/cyclone4-handbook.pdf; ComponentLink3Description: Pinout Specification; ComponentLink3URL: http://www.altera.com/literature/lit-dp.jsp?category=cyc%204&showspreadsheet=y; ComponentLink4Description: Packaging Specification; ComponentLink4URL: http://www.altera.com/literature/ds/dspkg.pdf
U5 = EPCS4SI8N: EPCS4 Series, In-system programmable 3.3V serial configuration device, 8-Pin SOIC, 4-Megabit, Industrial Grade, Pb-Free; Configures: Cyclone II, Stratix II, & Cyclone Devices; Published: 4-Mar-2005; LatestRevisionDate: 13-Apr-2006; LatestRevisionNote: IPC-7351 Footprint Added.; DatasheetVersion: ver2.0, Oct-2003; PackageVersion: ver14.2, Oct-2005; PackageReference: SOIC8; Publisher: Altium Limited; PackageDescription: 8-Pin Small Outline Integrated Circuit Package (SOIC8); Supplier 1: Digi-Key; Supplier Part Number 1: 544-1379-5-ND; Supplier 2: Farnell; Supplier Part Number 2: 1662262; Supplier 3: Farnell; Supplier Part Number 3: 1453496; Code_JEDEC: MS-012-AA; Code_IPC: SOIC127P600-8; ComponentLink1Description: Manufacturer Link; ComponentLink1URL: http://www.altera.com/products/devices/config/cfg-index.html; ComponentLink2Description: Configuration Handbook; ComponentLink2URL: http://www.altera.com/literature/hb/cfg/config_handbook.pdf; ComponentLink3Description: Pinout Specification; ComponentLink3URL: http://www.altera.com/literature/hb/cfg/cyc_c51014.pdf; ComponentLink4Description: Packaging Specification; ComponentLink4URL: http://www.altera.com/literature/ds/dspkg.pdf
U6 = IDC-10: Text Field1: 40; Text Field2: 60

## Sheet Timing Unit.SchDoc
size A4; DocumentNumber: 4; SheetNumber: 4; SheetTotal: 7
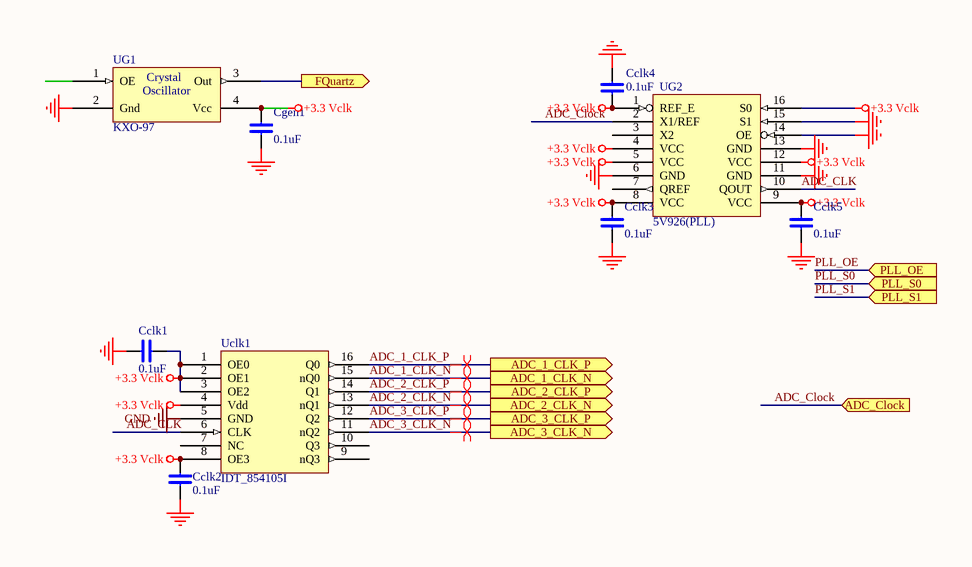
[diagram p8: Timing Unit.SchDoc]

### Parts
Cclk1  0.1uF  [chip0603]
Cclk2  0.1uF  [chip0603]
Cclk3  0.1uF  [chip0603]
Cclk4  0.1uF  [chip0603]
Cclk5  0.1uF  [chip0603]
Cgen1  0.1uF  [chip0603]
Uclk1  IDT_854105I  [TSSOP16]
UG1  KXO-97  [SG-636]
UG2  5V926(PLL)  [TSSOP16]

### Ports
ADC_1_CLK_N (out), ADC_1_CLK_P (out), ADC_2_CLK_N (out), ADC_2_CLK_P (out), ADC_3_CLK_N (out), ADC_3_CLK_P (out), ADC_Clock (in), FQuartz (out), PLL_OE (in), PLL_S0 (in), PLL_S1 (in)

### Nets
+3.3 Vclk: Cclk1.2 Cclk2.2 Cclk3.2 Cclk4.2 Cclk5.2 Cgen1.2 Uclk1.1(OE0) Uclk1.2(OE1) Uclk1.3(OE2) Uclk1.4(Vdd) Uclk1.8(OE3) UG1.4(Vcc) UG2.1(REF_E) UG2.4(VCC) UG2.5(VCC) UG2.8(VCC) UG2.9(VCC) UG2.12(VCC) UG2.16(S0)
GND: Cclk1.1 Cclk2.1 Cclk3.1 Cclk4.1 Cclk5.1 Cgen1.1 Uclk1.5(GND) UG1.2(Gnd) UG2.6(GND) UG2.11(GND) UG2.13(GND) UG2.14(OE) UG2.15(S1)
ADC_1_CLK_N: Uclk1.15(nQ0) ; port ADC_1_CLK_N
ADC_1_CLK_P: Uclk1.16(Q0) ; port ADC_1_CLK_P
ADC_2_CLK_N: Uclk1.13(nQ1) ; port ADC_2_CLK_N
ADC_2_CLK_P: Uclk1.14(Q1) ; port ADC_2_CLK_P
ADC_3_CLK_N: Uclk1.11(nQ2) ; port ADC_3_CLK_N
ADC_3_CLK_P: Uclk1.12(Q2) ; port ADC_3_CLK_P
ADC_CLK: Uclk1.6(CLK) UG2.10(QOUT)
ADC_Clock: UG2.2(X1/REF) ; port ADC_Clock
FQuartz: UG1.3(Out) ; port FQuartz

Not connected (* = marked no-connect by the designer): Uclk1 7(NC) 9(nQ3) 10(Q3); UG1 1(OE); UG2 3(X2) 7(QREF)

### Layout directives
differential pair: ADC_1_CLK_N, ADC_1_CLK_P, ADC_2_CLK_N, ADC_2_CLK_P, ADC_3_CLK_N, ADC_3_CLK_P

### Notes on the sheet
- (in symbol SG-636) Crystal; Oscillator

### Library data of the parts
Cclk1-Cclk5 Cgen1 = C: Text Field1: 20; Text Field2: 10
UG1 = SG-636: Crystal Oscillator (SMD)

## Sheet In-Out.SchDoc
size A4; DocumentNumber: 7; SheetNumber: 7; SheetTotal: 7
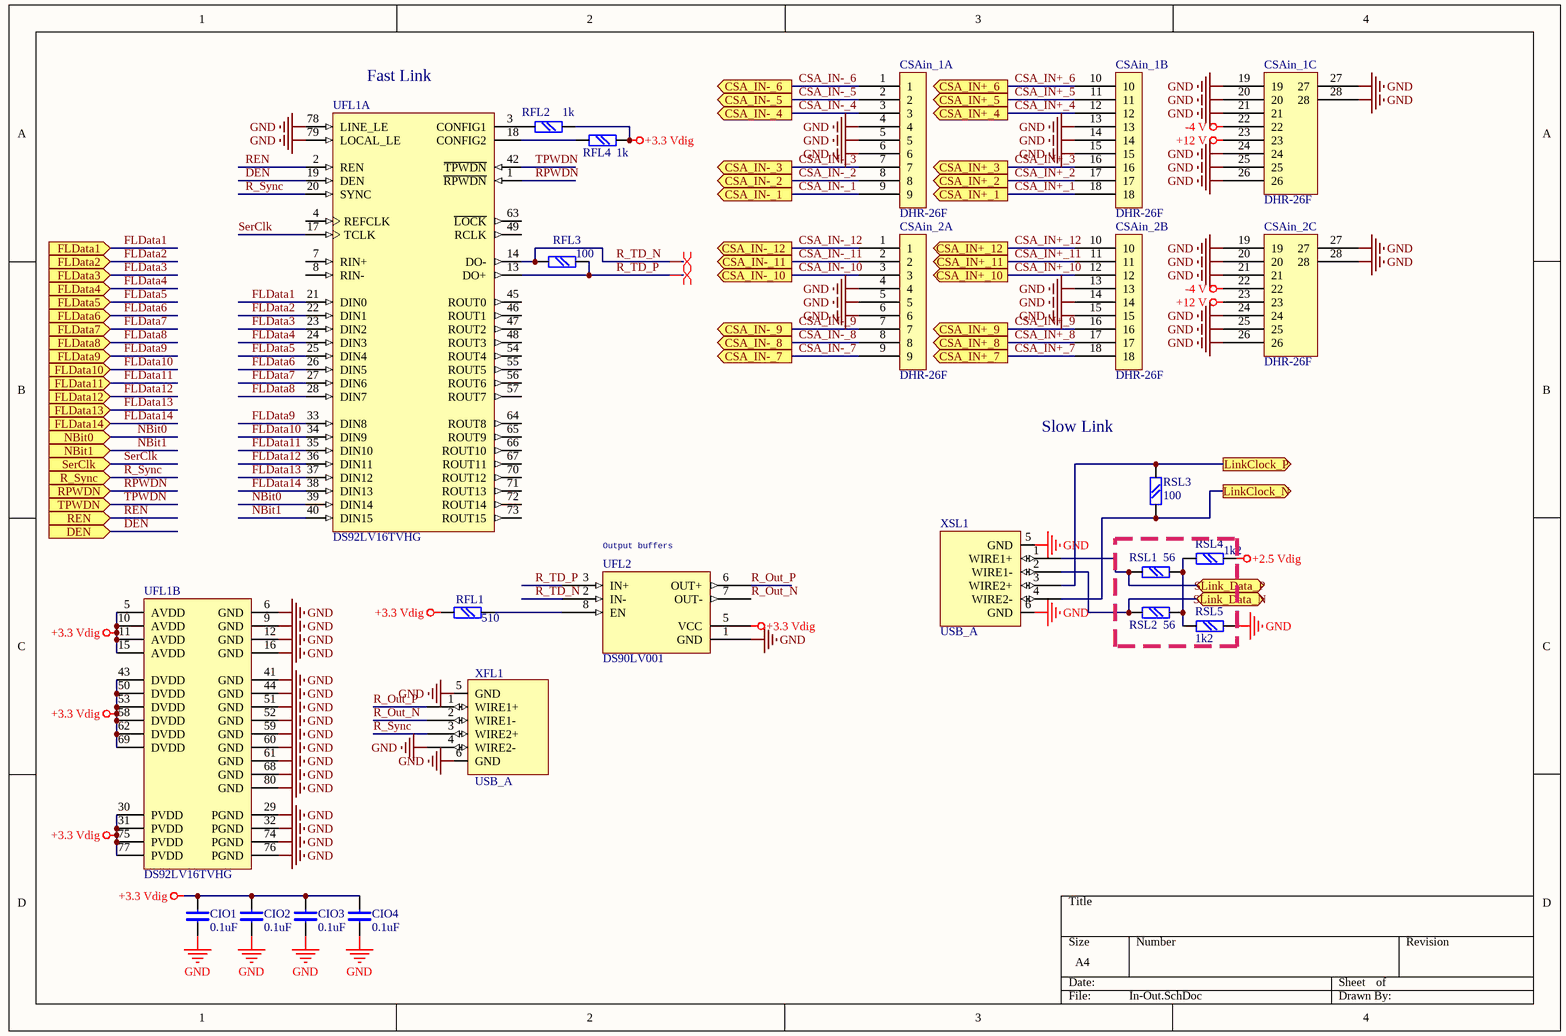
[diagram p9: In-Out.SchDoc]

### Parts
CIO1  0.1uF  [chip0603]
CIO2  0.1uF  [chip0603]
CIO3  0.1uF  [chip0603]
CIO4  0.1uF  [chip0603]
CSAin_1  DHR-26F  [DHR-F-26]  (parts A,B,C of 3)
CSAin_2  DHR-26F  [DHR-F-26]  (parts A,B,C of 3)
RFL1  510  [chip0603]
RFL2  1k  [chip0603]
RFL3  100  [chip0603]
RFL4  1k  [chip0603]
RSL1  56  [chip0603]
RSL2  56  [chip0603]
RSL3  100  [chip0603]
RSL4  1k2  [chip0603]
RSL5  1k2  [chip0603]
UFL1  DS92LV16TVHG  [VHG80A_N]  (parts A,B of 2)
UFL2  DS90LV001  [8SO200]
XFL1  USB_A  [USB2.5-2H4B]
XSL1  USB_A  [USB2.5-2H4B]

### Ports
CSA_IN+_1 (out), CSA_IN+_2 (out), CSA_IN+_3 (out), CSA_IN+_4 (out), CSA_IN+_5 (out), CSA_IN+_6 (out), CSA_IN+_7 (out), CSA_IN+_8 (out), CSA_IN+_9 (out), CSA_IN+_10 (out), CSA_IN+_11 (out), CSA_IN+_12 (out), CSA_IN-_1 (out), CSA_IN-_2 (out), CSA_IN-_3 (out), CSA_IN-_4 (out), CSA_IN-_5 (out), CSA_IN-_6 (out), CSA_IN-_7 (out), CSA_IN-_8 (out), CSA_IN-_9 (out), CSA_IN-_10 (out), CSA_IN-_11 (out), CSA_IN-_12 (out), DEN (in), FLData1 (in), FLData2 (in), FLData3 (in), FLData4 (in), FLData5 (in), FLData6 (in), FLData7 (in), FLData8 (in), FLData9 (in), FLData10 (in), FLData11 (in), FLData12 (in), FLData13 (in), FLData14 (in), LinkClock_N (out), LinkClock_P (out), NBit0 (in), NBit1 (in), R_Sync (in), REN (in), RPWDN (in), SerClk (in), SLink_Data_N (bidir), SLink_Data_P (bidir), TPWDN (in)

### Nets
+2.5 Vdig: RSL4.2
+3.3 Vdig: CIO1.2 CIO2.2 CIO3.2 CIO4.2 RFL1.1 RFL2.2 RFL4.2 UFL1.5(AVDD) UFL1.10(AVDD) UFL1.11(AVDD) UFL1.15(AVDD) UFL1.30(PVDD) UFL1.31(PVDD) UFL1.43(DVDD) UFL1.50(DVDD) UFL1.53(DVDD) UFL1.58(DVDD) UFL1.62(DVDD) UFL1.69(DVDD) UFL1.75(PVDD) UFL1.77(PVDD) UFL2.5(VCC)
+12 V: CSAin_1.23 CSAin_2.23
-4 V: CSAin_1.22 CSAin_2.22
GND: CIO1.1 CIO2.1 CIO3.1 CIO4.1 CSAin_1.4 CSAin_1.5 CSAin_1.6 CSAin_1.13 CSAin_1.14 CSAin_1.15 CSAin_1.19 CSAin_1.20 CSAin_1.21 CSAin_1.24 CSAin_1.25 CSAin_1.26 CSAin_1.27 CSAin_1.28 CSAin_2.4 CSAin_2.5 CSAin_2.6 CSAin_2.13 CSAin_2.14 CSAin_2.15 CSAin_2.19 CSAin_2.20 CSAin_2.21 CSAin_2.24 CSAin_2.25 CSAin_2.26 CSAin_2.27 CSAin_2.28 RSL5.1 UFL1.6(GND) UFL1.9(GND) UFL1.12(GND) UFL1.16(GND) UFL1.29(PGND) UFL1.32(PGND) UFL1.41(GND) UFL1.44(GND) UFL1.51(GND) UFL1.52(GND) UFL1.59(GND) UFL1.60(GND) UFL1.61(GND) UFL1.68(GND) UFL1.74(PGND) UFL1.76(PGND) UFL1.78(LINE_LE) UFL1.79(LOCAL_LE) UFL1.80(GND) UFL2.1(GND) XFL1.4(WIRE2-) XFL1.5(GND) XFL1.6(GND) XSL1.5(GND) XSL1.6(GND)
LinkClk_N: RSL3.1 XSL1.4(WIRE2-) ; port LinkClock_N
LinkClk_P: RSL3.2 XSL1.3(WIRE2+) ; port LinkClock_P
CSA_IN+_1: CSAin_1.18 ; port CSA_IN+_1
CSA_IN+_2: CSAin_1.17 ; port CSA_IN+_2
CSA_IN+_3: CSAin_1.16 ; port CSA_IN+_3
CSA_IN+_4: CSAin_1.12 ; port CSA_IN+_4
CSA_IN+_5: CSAin_1.11 ; port CSA_IN+_5
CSA_IN+_6: CSAin_1.10 ; port CSA_IN+_6
CSA_IN+_7: CSAin_2.18 ; port CSA_IN+_7
CSA_IN+_8: CSAin_2.17 ; port CSA_IN+_8
CSA_IN+_9: CSAin_2.16 ; port CSA_IN+_9
CSA_IN+_10: CSAin_2.12 ; port CSA_IN+_10
CSA_IN+_11: CSAin_2.11 ; port CSA_IN+_11
CSA_IN+_12: CSAin_2.10 ; port CSA_IN+_12
CSA_IN-_1: CSAin_1.9 ; port CSA_IN-_1
CSA_IN-_2: CSAin_1.8 ; port CSA_IN-_2
CSA_IN-_3: CSAin_1.7 ; port CSA_IN-_3
CSA_IN-_4: CSAin_1.3 ; port CSA_IN-_4
CSA_IN-_5: CSAin_1.2 ; port CSA_IN-_5
CSA_IN-_6: CSAin_1.1 ; port CSA_IN-_6
CSA_IN-_7: CSAin_2.9 ; port CSA_IN-_7
CSA_IN-_8: CSAin_2.8 ; port CSA_IN-_8
CSA_IN-_9: CSAin_2.7 ; port CSA_IN-_9
CSA_IN-_10: CSAin_2.3 ; port CSA_IN-_10
CSA_IN-_11: CSAin_2.2 ; port CSA_IN-_11
CSA_IN-_12: CSAin_2.1 ; port CSA_IN-_12
DEN: UFL1.19(DEN) ; port DEN
FLData1: UFL1.21(DIN0) ; port FLData1
FLData2: UFL1.22(DIN1) ; port FLData2
FLData3: UFL1.23(DIN2) ; port FLData3
FLData4: UFL1.24(DIN3) ; port FLData4
FLData5: UFL1.25(DIN4) ; port FLData5
FLData6: UFL1.26(DIN5) ; port FLData6
FLData7: UFL1.27(DIN6) ; port FLData7
FLData8: UFL1.28(DIN7) ; port FLData8
FLData9: UFL1.33(DIN8) ; port FLData9
FLData10: UFL1.34(DIN9) ; port FLData10
FLData11: UFL1.35(DIN10) ; port FLData11
FLData12: UFL1.36(DIN11) ; port FLData12
FLData13: UFL1.37(DIN12) ; port FLData13
FLData14: UFL1.38(DIN13) ; port FLData14
NBit0: UFL1.39(DIN14) ; port NBit0
NBit1: UFL1.40(DIN15) ; port NBit1
R_Out_N: UFL2.7(OUT-) XFL1.2(WIRE1-)
R_Out_P: UFL2.6(OUT+) XFL1.1(WIRE1+)
R_Sync: UFL1.20(SYNC) XFL1.3(WIRE2+) ; port R_Sync
R_TD_N: RFL3.1 UFL1.14(DO-) UFL2.2(IN-)
R_TD_P: RFL3.2 UFL1.13(DO+) UFL2.3(IN+)
REN: UFL1.2(REN) ; port REN
RPWDN: UFL1.1(~{RPWDN}) ; port RPWDN
SerClk: UFL1.17(TCLK) ; port SerClk
SLink_Data_N: RSL2.2 XSL1.2(WIRE1-) ; port SLink_Data_N
SLink_Data_P: RSL1.2 XSL1.1(WIRE1+) ; port SLink_Data_P
TPWDN: UFL1.42(~{TPWDN}) ; port TPWDN
NetRFL1_2: RFL1.2 UFL2.8(EN)
NetRFL2_1: RFL2.1 UFL1.3(CONFIG1)
NetRFL4_1: RFL4.1 UFL1.18(CONFIG2)
NetRSL1_1: RSL1.1 RSL2.1 RSL4.1 RSL5.2

Not connected (* = marked no-connect by the designer): UFL1 4(REFCLK) 7(RIN+) 8(RIN-) 45(ROUT0) 46(ROUT1) 47(ROUT2) 48(ROUT3) 49(RCLK) 54(ROUT4) 55(ROUT5) 56(ROUT6) 57(ROUT7) 63(~{LOCK}) 64(ROUT8) 65(ROUT9) 66(ROUT10) 67(ROUT11) 70(ROUT12) 71(ROUT13) 72(ROUT14) 73(ROUT15)

### Layout directives
differential pair: R_TD_N, R_TD_P

### Notes on the sheet
- (near UFL1) Fast Link
- Slow Link
- (near UFL2) Output buffers

### Library data of the parts
CIO1-CIO4 = C: Text Field1: 20; Text Field2: 10
RFL1-RFL4 RSL1-RSL5 = R: Text Field1: 20; Text Field2: 20
UFL1 = DS92LV16TVHG: 16-Bit Bus LVDS Serializer/Deserializer - 25 - 80 MHz, 80-pin LQFP; Manufacturer: National Semiconductor; PackageTopMarking: NSUZXYTTE#*DS92LV16TVHG*BBBBB; PowerWise: N; CompType: Interface IC; Published: 4-Dec-2008; DatasheetVersion: Feb-2002; PackageVersion: revE, Feb-2005; PackageReference: VHG80A; Publisher: Altium Limited; PackageDescription: LQFP, Jedec, Metric, 12 x 12 x 1.4mm, 80 Lead, 0.5mm Pitch; Supplier 1: Farnell; Supplier Part Number 1: 8206848; PartNumber: DS92LV16TVHG; RoHS: N; PinCount: 80; Code_JEDEC: MS-026-BDD; ComponentLink1Description: DS92LV16 Datasheet; ComponentLink1URL: http://www.national.com/ds/DS/DS92LV16.pdf; ComponentLink2Description: DS92LV16 Web Page; ComponentLink2URL: http://www.national.com/pf/DS/DS92LV16.html; ComponentLink3Description: VHG80A Package Page; ComponentLink3URL: http://www.national.com/packaging/folders/vhg80a.html
UFL2 = DS90LV001: Text Field1: 80; Text Field2: 40
XFL1 XSL1 = USB_A: Text Field1: 60; Text Field2: 70

## Sheet Ethernet.SchDoc
size A3; DocumentNumber: 6; SheetNumber: 6; SheetTotal: 7
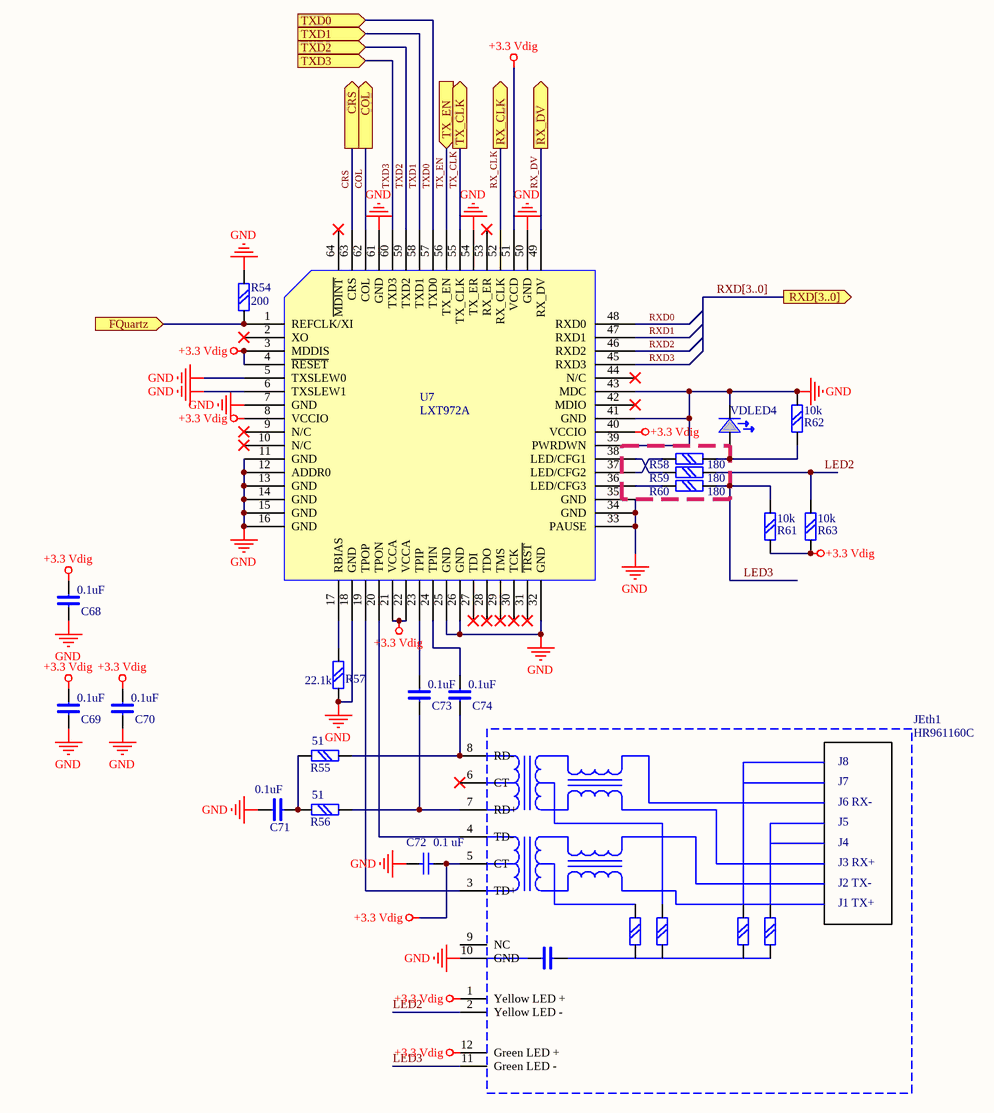
[diagram p10: Ethernet.SchDoc]

### Parts
C68  0.1uF  [chip0603]
C69  0.1uF  [chip0603]
C70  0.1uF  [chip0603]
C71  0.1uF  [chip0603]
C72  value 0.1 uF  [chip0603]  (hidden comment: 0.1uF)
C73  0.1uF  [chip0603]
C74  0.1uF  [chip0603]
JEth1  HR961160C  [HR961160C]
R54  200  [chip0603]
R55  51  [chip0603]
R56  51  [chip0603]
R57  22.1k  [chip0603]
R58  180  [chip0603]
R59  180  [chip0603]
R60  180  [chip0603]
R61  10k  [chip0603]
R62  10k  [chip0603]
R63  10k  [chip0603]
U7  LXT972A  [TQFP64]
VDLED4  LED  [LED0805]  (value not drawn)

### Ports
COL (out), CRS (out), FQuartz (in), RX_CLK (out), RX_DV (out), RXD[3..0] (out), TX_CLK (out), TX_EN (in), TXD0 (in), TXD1 (in), TXD2 (in), TXD3 (in)

### Nets
+3.3 Vdig: C68.2 C69.2 C70.2 C72.2 JEth1.1(Yellow_LED_+) JEth1.5(CT) JEth1.12(Green_LED_+) R61.1 R63.1 U7.3(MDDIS) U7.4(~{RESET}) U7.8(VCCIO) U7.21(VCCA) U7.22(VCCA) U7.40(VCCIO) U7.51(VCCD)
GND: C68.1 C69.1 C70.1 C71.2 C72.1 JEth1.10(GND) R54.2 R57.2 R62.2 U7.5(TXSLEW0) U7.6(TXSLEW1) U7.7(GND) U7.11(GND) U7.12(ADDR0) U7.13(GND) U7.14(GND) U7.15(GND) U7.16(GND) U7.18(GND) U7.25(GND) U7.26(GND) U7.32(GND) U7.33(PAUSE) U7.34(GND) U7.35(GND) U7.39(PWRDWN) U7.41(GND) U7.43(MDC) U7.50(GND) U7.54(TX_ER) U7.61(GND) VDLED4.CATH
COL: U7.62(COL) ; port COL
CRS: U7.63(CRS) ; port CRS
FQuartz: R54.1 U7.1(REFCLK/XI) ; port FQuartz
LED2: JEth1.2(Yellow_LED_-) R59.2 R63.2
LED3: JEth1.11(Green_LED_-) R60.2 R61.2
RX_CLK: U7.52(RX_CLK) ; port RX_CLK  [project net EthRX_CLK]
RX_DV: U7.49(RX_DV) ; port RX_DV  [project net EthRX_D V]
RXD0: U7.48(RXD0)  [project net EthRXD0]
RXD1: U7.47(RXD1)  [project net EthRXD1]
RXD2: U7.46(RXD2)  [project net EthRXD2]
RXD3: U7.45(RXD3)  [project net EthRXD3]
TX_CLK: U7.55(TX_CLK) ; port TX_CLK  [project net EthTX_CLK]
TX_EN: U7.56(TX_EN) ; port TX_EN  [project net EthTX_EN]
TXD0: U7.57(TXD0) ; port TXD0  [project net EthTXD0]
TXD1: U7.58(TXD1) ; port TXD1  [project net EthTXD1]
TXD2: U7.59(TXD2) ; port TXD2  [project net EthTXD2]
TXD3: U7.60(TXD3) ; port TXD3  [project net EthTXD3]
NetC71_1: C71.1 R55.1 R56.2
NetC73_1: C73.1 JEth1.7(RD+) R56.1
NetC73_2: C73.2 U7.23(TPIP)
NetC74_1: C74.1 JEth1.8(RD-) R55.2
NetC74_2: C74.2 U7.24(TPIN)
NetJEth1_3: JEth1.3(TD+) U7.19(TPOP)
NetJEth1_4: JEth1.4(TD-) U7.20(TPON)
NetR57_1: R57.1 U7.17(RBIAS)
NetR58_1: R58.1 U7.37(LED/CFG2)
NetR58_2: R58.2 R62.1 VDLED4.ANOD
NetR59_1: R59.1 U7.38(LED/CFG1)
NetR60_1: R60.1 U7.36(LED/CFG3)

Not connected (* = marked no-connect by the designer): JEth1 6(CT)* 9(NC); U7 2(XO)* 9(N/C)* 10(N/C)* 27(TDI)* 28(TDO)* 29(TMS)* 30(TCK)* 31(~{TRST})* 42(MDIO)* 44(N/C)* 53(RX_ER)* 64(~{MDINT})*

### Buses and harness runs
bus RXD[3..0] = port RXD[3..0]

### Notes on the sheet
- (in symbol HR961160C) J8; J7; J6 RX-; J5; J4; J3 RX+; J2 TX-; J1 TX+

### Library data of the parts
C68-C71 C73 C74 = C: Text Field1: 20; Text Field2: 10
C72 = Cap: Capacitor; Published: 8-Jun-2000; LatestRevisionDate: 17-Jul-2002; LatestRevisionNote: Re-released for DXP Platform.; Publisher: Altium Limited
R54-R63 = R: Text Field1: 20; Text Field2: 20
VDLED4 = AL307: Text Field1: 10; Text Field2: 30

## Sheet SRAM.SchDoc
size A4
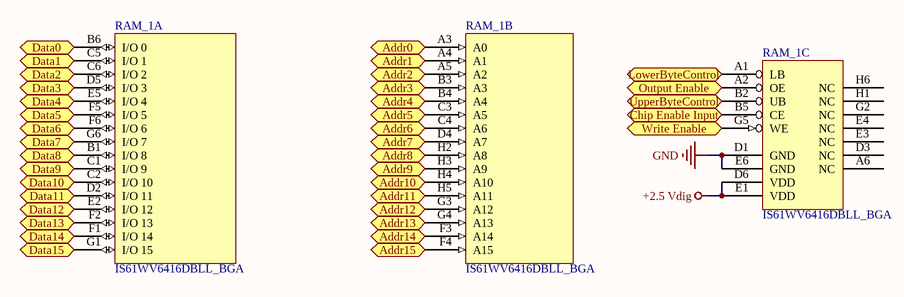
[diagram p11: SRAM.SchDoc]

### Parts
RAM_1  IS61WV6416DBLL_BGA  [TF-BGA 48L 6x8mm]  (parts A,B,C of 3)

### Ports
Addr0 (in), Addr1 (in), Addr2 (in), Addr3 (in), Addr4 (in), Addr5 (in), Addr6 (in), Addr7 (in), Addr8 (in), Addr9 (in), Addr10 (in), Addr11 (in), Addr12 (in), Addr13 (in), Addr14 (in), Addr15 (in), Chip Enable Input (in), Data0 (bidir), Data1 (bidir), Data2 (bidir), Data3 (bidir), Data4 (bidir), Data5 (bidir), Data6 (bidir), Data7 (bidir), Data8 (bidir), Data9 (bidir), Data10 (bidir), Data11 (bidir), Data12 (bidir), Data13 (bidir), Data14 (bidir), Data15 (bidir), LowerByteControl (in), Output Enable (in), UpperByteControl (in), Write Enable (in)

### Nets
+2.5 Vdig: RAM_1.D6(VDD) RAM_1.E1(VDD)
GND: RAM_1.D1(GND) RAM_1.E6(GND)
AddrRAM0: RAM_1.A3(A0) ; port Addr0
AddrRAM1: RAM_1.A4(A1) ; port Addr1
AddrRAM2: RAM_1.A5(A2) ; port Addr2
AddrRAM3: RAM_1.B3(A3) ; port Addr3
AddrRAM4: RAM_1.B4(A4) ; port Addr4
AddrRAM5: RAM_1.C3(A5) ; port Addr5
AddrRAM6: RAM_1.C4(A6) ; port Addr6
AddrRAM7: RAM_1.D4(A7) ; port Addr7
AddrRAM8: RAM_1.H2(A8) ; port Addr8
AddrRAM9: RAM_1.H3(A9) ; port Addr9
AddrRAM10: RAM_1.H4(A10) ; port Addr10
AddrRAM11: RAM_1.H5(A11) ; port Addr11
AddrRAM12: RAM_1.G3(A12) ; port Addr12
AddrRAM13: RAM_1.G4(A13) ; port Addr13
AddrRAM14: RAM_1.F3(A14) ; port Addr14
AddrRAM15: RAM_1.F4(A15) ; port Addr15
CE_RAM: RAM_1.B5(CE) ; port Chip Enable Input
DataRAM0: RAM_1.B6(I/O_0) ; port Data0
DataRAM1: RAM_1.C5(I/O_1) ; port Data1
DataRAM2: RAM_1.C6(I/O_2) ; port Data2
DataRAM3: RAM_1.D5(I/O_3) ; port Data3
DataRAM4: RAM_1.E5(I/O_4) ; port Data4
DataRAM5: RAM_1.F5(I/O_5) ; port Data5
DataRAM6: RAM_1.F6(I/O_6) ; port Data6
DataRAM7: RAM_1.G6(I/O_7) ; port Data7
DataRAM8: RAM_1.B1(I/O_8) ; port Data8
DataRAM9: RAM_1.C1(I/O_9) ; port Data9
DataRAM10: RAM_1.C2(I/O_10) ; port Data10
DataRAM11: RAM_1.D2(I/O_11) ; port Data11
DataRAM12: RAM_1.E2(I/O_12) ; port Data12
DataRAM13: RAM_1.F2(I/O_13) ; port Data13
DataRAM14: RAM_1.F1(I/O_14) ; port Data14
DataRAM15: RAM_1.G1(I/O_15) ; port Data15
LB_RAM: RAM_1.A1(LB) ; port LowerByteControl
OE_RAM: RAM_1.A2(OE) ; port Output Enable
UB_RAM: RAM_1.B2(UB) ; port UpperByteControl
WE_RAM: RAM_1.G5(WE) ; port Write Enable

Not connected (* = marked no-connect by the designer): RAM_1 A6(NC) D3(NC) E3(NC) E4(NC) G2(NC) H1(NC) H6(NC)